# EAGLE design generic_victim (EAGLE 6.5.0)

## Sheet 1 of 5
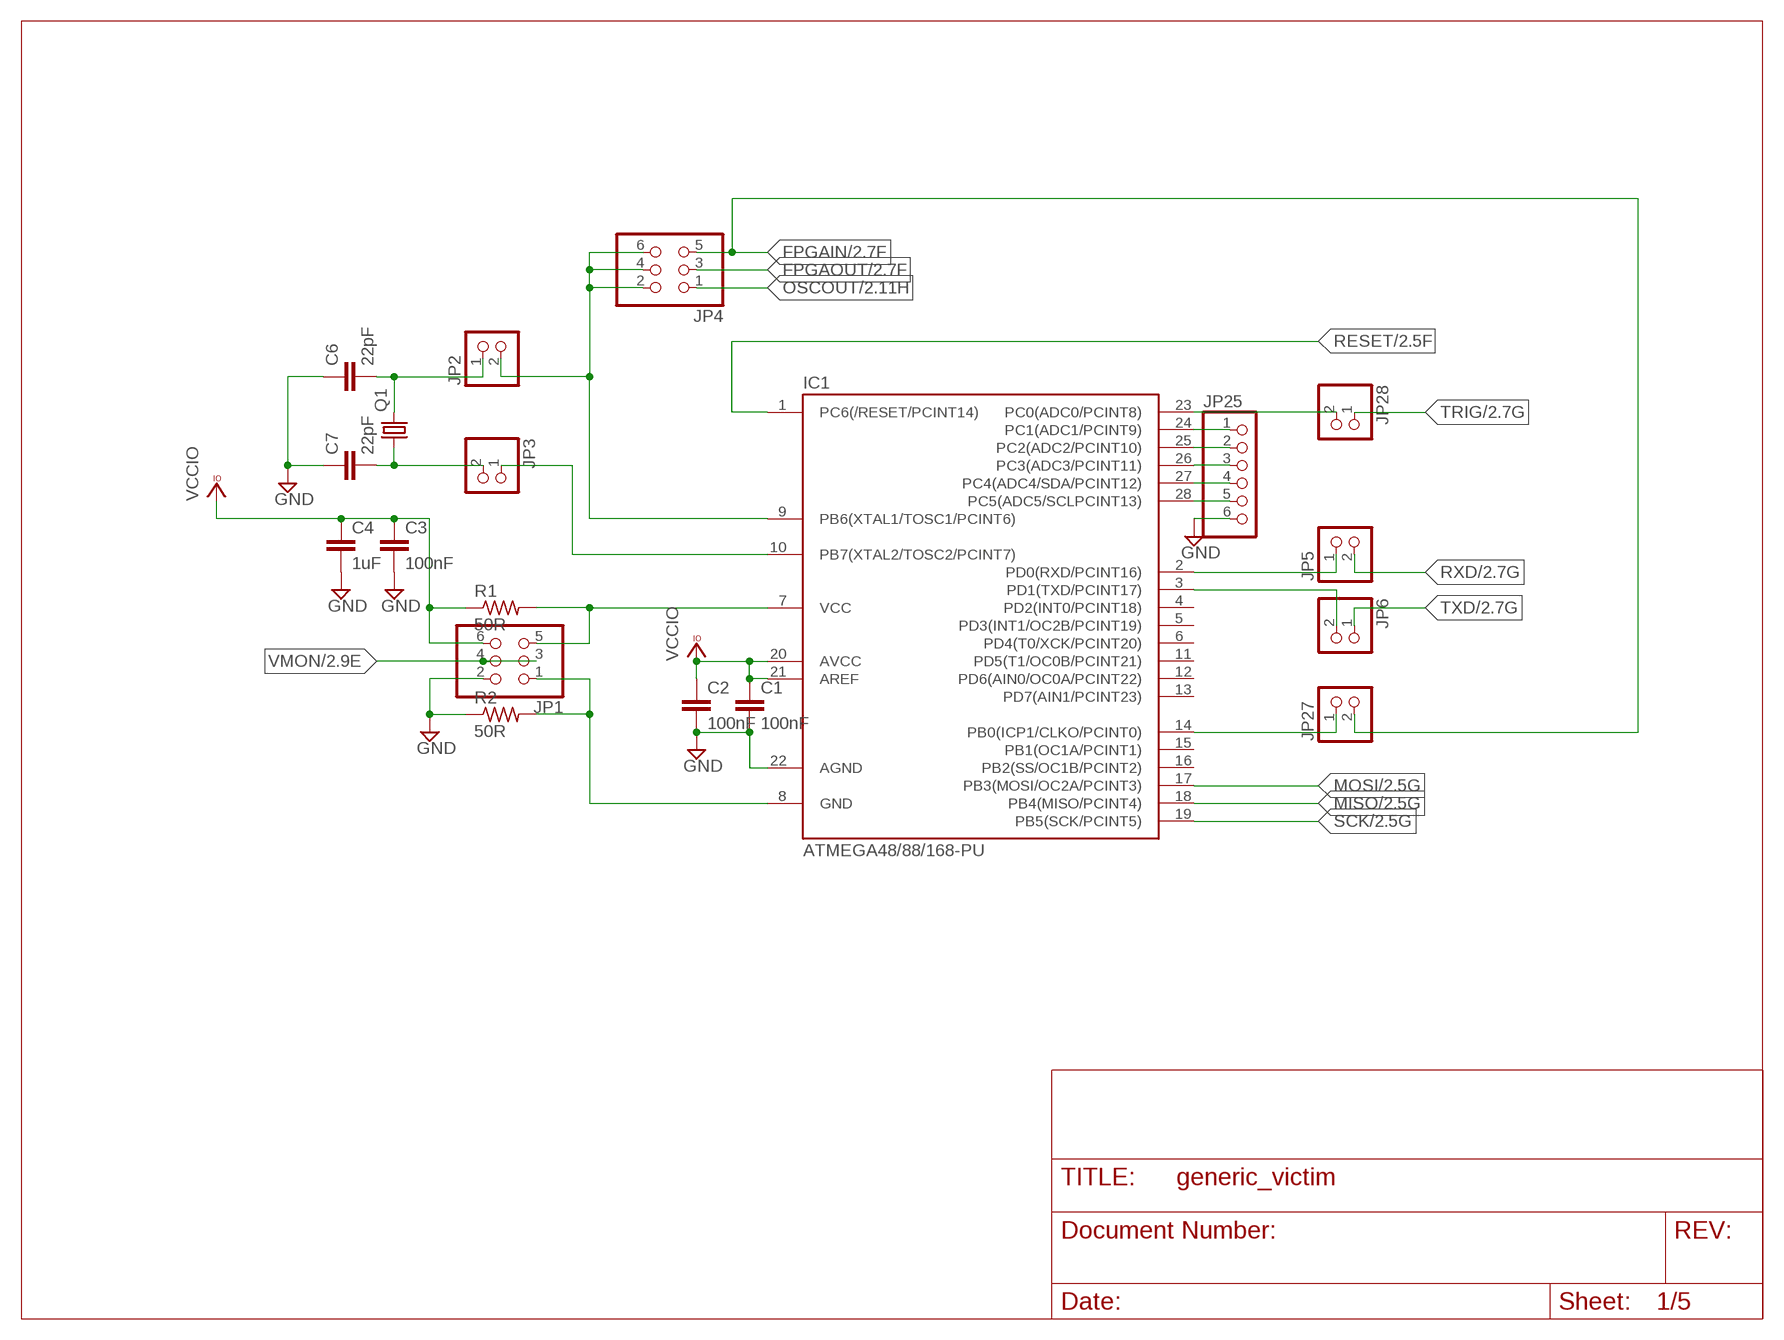
[diagram p0: schematic, sheet 1]

### Parts
C1  100nF  C-EUC0805  [C0805]
C2  100nF  C-EUC0805  [C0805]
C3  100nF  C-EUC0805  [C0805]
C4  1uF  C-EUC0805  [C0805]
C6  22pF  C-EUC0805  [C0805]
C7  22pF  C-EUC0805  [C0805]
IC1  ATMEGA48/88/168-PU  [DIL28-3]
JP1  PINHD-2X3  [2X03]
JP2  PINHD-1X2  [1X02]
JP3  PINHD-1X2  [1X02]
JP4  PINHD-2X3  [2X03]
JP5  PINHD-1X2  [1X02]
JP6  PINHD-1X2  [1X02]
JP25  PINHD-1X6  [1X06]
JP27  PINHD-1X2  [1X02]
JP28  PINHD-1X2  [1X02]
Q1  CRYSTALHC49U70  [HC49U70]
R1  50R  R-US_R0805  [R0805]
R2  50R  R-US_R0805  [R0805]

### Nets
FPGAIN: JP4.5 JP27.2 ; also sheet 2,3,4
FPGAOUT: JP4.3 ; also sheet 2,3
GND: C1.2 C2.2 C3.2 C4.2 C6.1 C7.1 IC1.22(AGND) JP1.2 JP25.6 R2.1 ; also sheet 2,3,4,5
MISO: IC1.18(PB4(MISO/PCINT4)) ; also sheet 2,3
MOSI: IC1.17(PB3(MOSI/OC2A/PCINT3)) ; also sheet 2,3
N$1: IC1.7(VCC) JP1.5 R1.2
N$3: IC1.8(GND) JP1.1 R2.2
N$4: IC1.10(PB7(XTAL2/TOSC2/PCINT7)) JP3.1
N$7: C7.2 JP3.2 Q1.1
N$8: C6.2 JP2.1 Q1.2
N$9: IC1.14(PB0(ICP1/CLKO/PCINT0)) JP27.1
N$10: IC1.2(PD0(RXD/PCINT16)) JP5.1
N$11: IC1.3(PD1(TXD/PCINT17)) JP6.2
N$31: IC1.9(PB6(XTAL1/TOSC1/PCINT6)) JP2.2 JP4.2 JP4.4 JP4.6
N$41: IC1.24(PC1(ADC1/PCINT9)) JP25.1
N$42: IC1.25(PC2(ADC2/PCINT10)) JP25.2
N$43: IC1.26(PC3(ADC3/PCINT11)) JP25.3
N$44: IC1.27(PC4(ADC4/SDA/PCINT12)) JP25.4
N$45: IC1.28(PC5(ADC5/SCLPCINT13)) JP25.5
N$47: IC1.23(PC0(ADC0/PCINT8)) JP28.2
OSCOUT: JP4.1 ; also sheet 2,3
RESET: IC1.1(PC6(/RESET/PCINT14)) ; also sheet 2,3
RXD: JP5.2 ; also sheet 2,3,4
SCK: IC1.19(PB5(SCK/PCINT5)) ; also sheet 2,3
TRIG: JP28.1 ; also sheet 2,3,4
TXD: JP6.1 ; also sheet 2,4
VCCIO: C1.1 C2.1 C3.1 C4.1 IC1.20(AVCC) IC1.21(AREF) JP1.6 R1.1 ; also sheet 2,3,4
VMON: JP1.3 JP1.4 ; also sheet 2,3,4,5
Unconnected: IC1.4(PD2(INT0/PCINT18)) IC1.5(PD3(INT1/OC2B/PCINT19)) IC1.6(PD4(T0/XCK/PCINT20)) IC1.11(PD5(T1/OC0B/PCINT21)) IC1.12(PD6(AIN0/OC0A/PCINT22)) IC1.13(PD7(AIN1/PCINT23)) IC1.15(PB1(OC1A/PCINT1)) IC1.16(PB2(SS/OC1B/PCINT2))

## Sheet 2 of 5
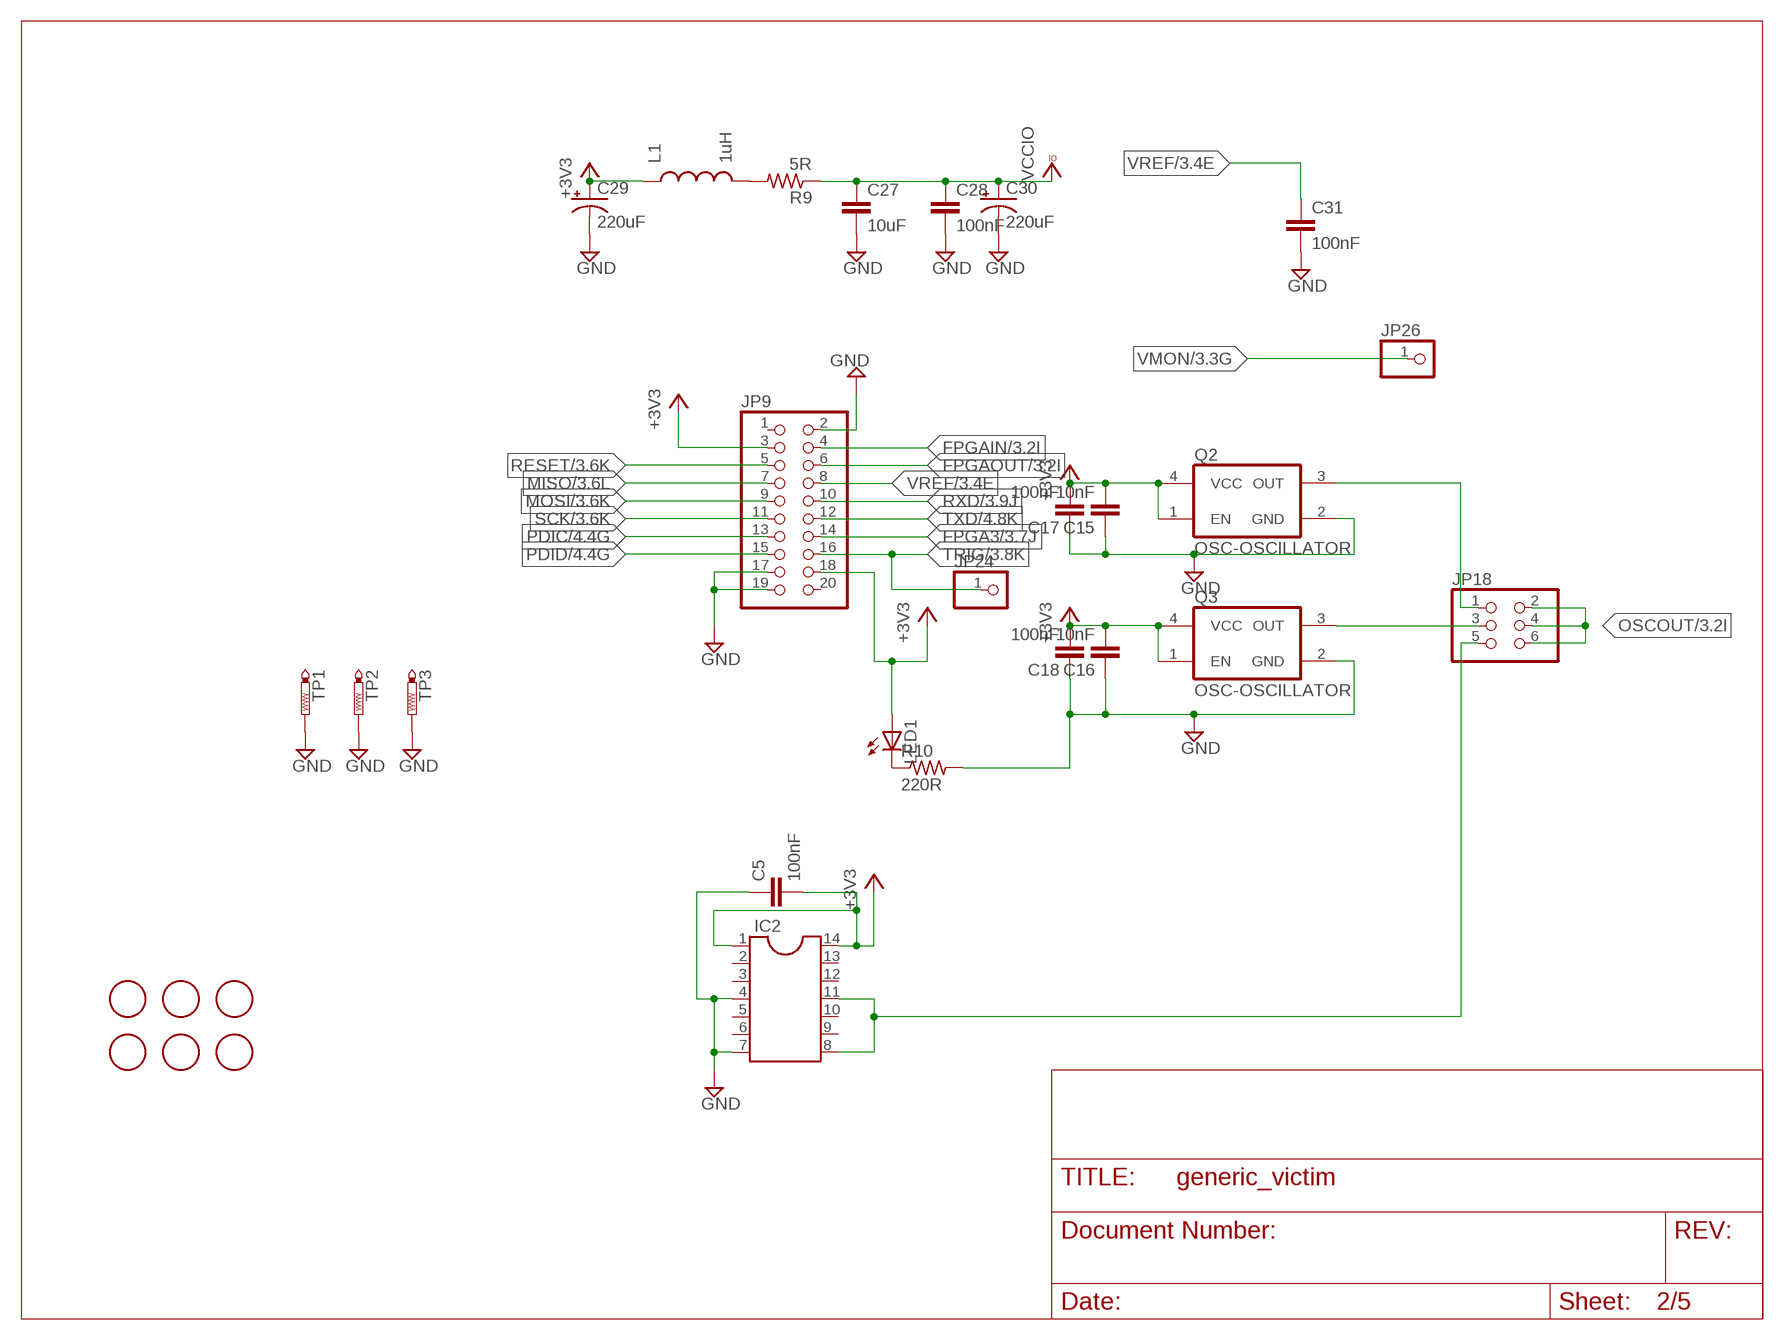
[diagram p1: schematic, sheet 2]

### Parts
C5  100nF  C-EUC0805  [C0805]
C15  10nF  C-EUC0603  [C0603]
C16  10nF  C-EUC0603  [C0603]
C17  100nF  C-EUC0603  [C0603]
C18  100nF  C-EUC0603  [C0603]
C27  10uF  C-EUC0805  [C0805]
C28  100nF  C-EUC0805  [C0805]
C29  220uF  CPOL-USE3.5-8  [E3,5-8]
C30  220uF  CPOL-USE3.5-8  [E3,5-8]
C31  100nF  C-EUC0805  [C0805]
IC2  DIL14S  [SOCKET-14]
JP9  PINHD-2X10  [2X10]
JP18  PINHD-2X3  [2X03]
JP24  PINHD-1X1  [1X01]
JP26  PINHD-1X1  [1X01]
L1  1uH  INDUCTOR0805  [0805]
LED1  LED3MM  [LED3MM]
Q2  OSC-OSCILLATOR  [OSCILLATOR_7X5_SMD]
Q3  OSC-OSCILLATOR  [OSCILLATOR_7X5_SMD]
R9  5R  R-US_R0805  [R0805]
R10  220R  R-US_R0805  [R0805]
TP1  PTR1PAD1-13  [P1-13]
TP2  PTR1PAD1-13  [P1-13]
TP3  PTR1PAD1-13  [P1-13]
U$1  FIDUCIAL  [FIDUCIAL_1MM]
U$2  FIDUCIAL  [FIDUCIAL_1MM]
U$3  FIDUCIAL  [FIDUCIAL_1MM]
U$4  FIDUCIAL  [FIDUCIAL_1MM]
U$5  FIDUCIAL  [FIDUCIAL_1MM]
U$6  FIDUCIAL  [FIDUCIAL_1MM]

### Nets
+3V3: C5.2 C15.2 C16.2 C17.2 C18.2 C29.+ IC2.1 IC2.14 JP9.3 JP9.18 L1.1 LED1.A Q2.1(EN) Q2.4(VCC) Q3.1(EN) Q3.4(VCC) ; also sheet 5
FPGA3: JP9.14 ; also sheet 3
FPGAIN: JP9.4 ; also sheet 1,3,4
FPGAOUT: JP9.6 ; also sheet 1,3
GND: C5.1 C15.1 C16.1 C17.1 C18.1 C27.2 C28.2 C29.- C30.- C31.2 IC2.4 IC2.7 JP9.2 JP9.17 JP9.19 Q2.2(GND) Q3.2(GND) R10.2 TP1.TP TP2.TP TP3.TP ; also sheet 1,3,4,5
MISO: JP9.7 ; also sheet 1,3
MOSI: JP9.9 ; also sheet 1,3
N$6: IC2.8 IC2.11 JP18.5
N$34: JP18.3 Q3.3(OUT)
N$35: JP18.1 Q2.3(OUT)
N$40: L1.2 R9.2
N$46: LED1.K(C) R10.1
OSCOUT: JP18.2 JP18.4 JP18.6 ; also sheet 1,3
PDIC: JP9.13 ; also sheet 4
PDID: JP9.15 ; also sheet 4
RESET: JP9.5 ; also sheet 1,3
RXD: JP9.10 ; also sheet 1,3,4
SCK: JP9.11 ; also sheet 1,3
TRIG: JP9.16 JP24.1 ; also sheet 1,3,4
TXD: JP9.12 ; also sheet 1,4
VCCIO: C27.1 C28.1 C30.+ R9.1 ; also sheet 1,3,4
VMON: JP26.1 ; also sheet 1,3,4,5
VREF: C31.1 JP9.8 ; also sheet 3
Unconnected: IC2.2 IC2.3 IC2.5 IC2.6 IC2.9 IC2.10 IC2.12 IC2.13 JP9.1 JP9.20

## Sheet 3 of 5
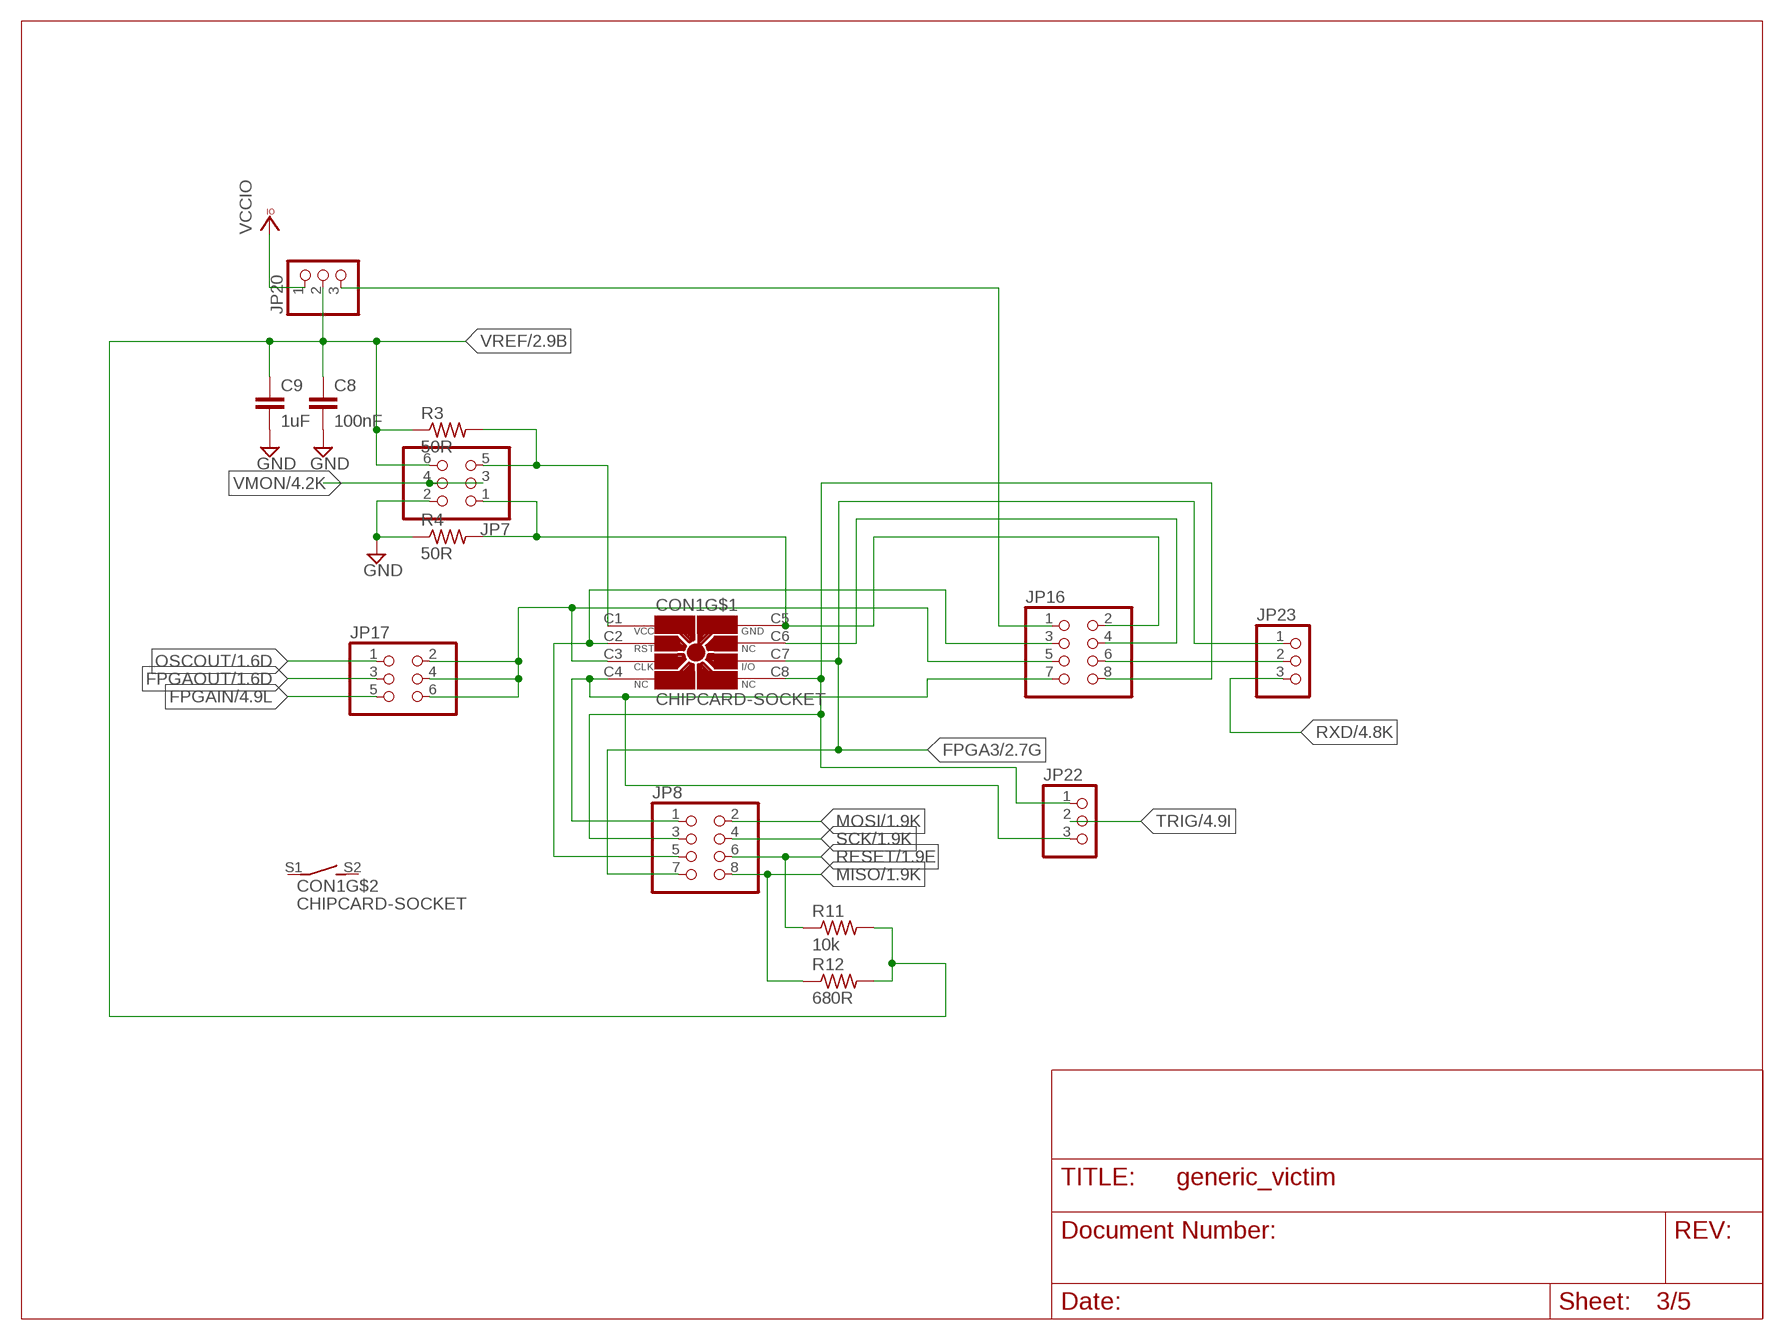
[diagram p2: schematic, sheet 3]

### Parts
C8  100nF  C-EUC0805  [C0805]
C9  1uF  C-EUC0805  [C0805]
CON1  CHIPCARD-SOCKET  [7334L2622F05LF]
JP7  PINHD-2X3  [2X03]
JP8  PINHD-2X4  [2X04]
JP16  PINHD-2X4  [2X04]
JP17  PINHD-2X3  [2X03]
JP20  PINHD-1X3  [1X03]
JP22  PINHD-1X3  [1X03]
JP23  PINHD-1X3  [1X03]
R3  50R  R-US_R0805  [R0805]
R4  50R  R-US_R0805  [R0805]
R11  10k  R-US_R0805  [R0805]
R12  680R  R-US_R0805  [R0805]

### Nets
FPGA3: CON1.C7(I/O) JP8.7 JP23.1 ; also sheet 2
FPGAIN: JP17.5 ; also sheet 1,2,4
FPGAOUT: JP17.3 ; also sheet 1,2
GND: C8.2 C9.2 JP7.2 R4.1 ; also sheet 1,2,4,5
MISO: JP8.8 R12.1 ; also sheet 1,2
MOSI: JP8.2 ; also sheet 1,2
N$2: CON1.C4(NC) JP8.1 JP16.7 JP22.3
N$12: CON1.C1(VCC) JP7.5 R3.2
N$13: CON1.C2(RST) JP8.5 JP16.3
N$14: CON1.C5(GND) JP7.1 JP16.2 R4.2
N$16: CON1.C8(NC) JP8.3 JP16.8 JP22.1
N$18: JP16.6 JP23.2
N$29: CON1.C6(NC) JP16.4
N$30: CON1.C3(CLK) JP16.5 JP17.2 JP17.4 JP17.6
N$32: JP16.1 JP20.3
OSCOUT: JP17.1 ; also sheet 1,2
RESET: JP8.6 R11.1 ; also sheet 1,2
RXD: JP23.3 ; also sheet 1,2,4
SCK: JP8.4 ; also sheet 1,2
TRIG: JP22.2 ; also sheet 1,2,4
VCCIO: JP20.1 ; also sheet 1,2,4
VMON: JP7.3 JP7.4 ; also sheet 1,2,4,5
VREF: C8.1 C9.1 JP7.6 JP20.2 R3.1 R11.2 R12.2 ; also sheet 2
Unconnected: CON1.S1 CON1.S2

## Sheet 4 of 5
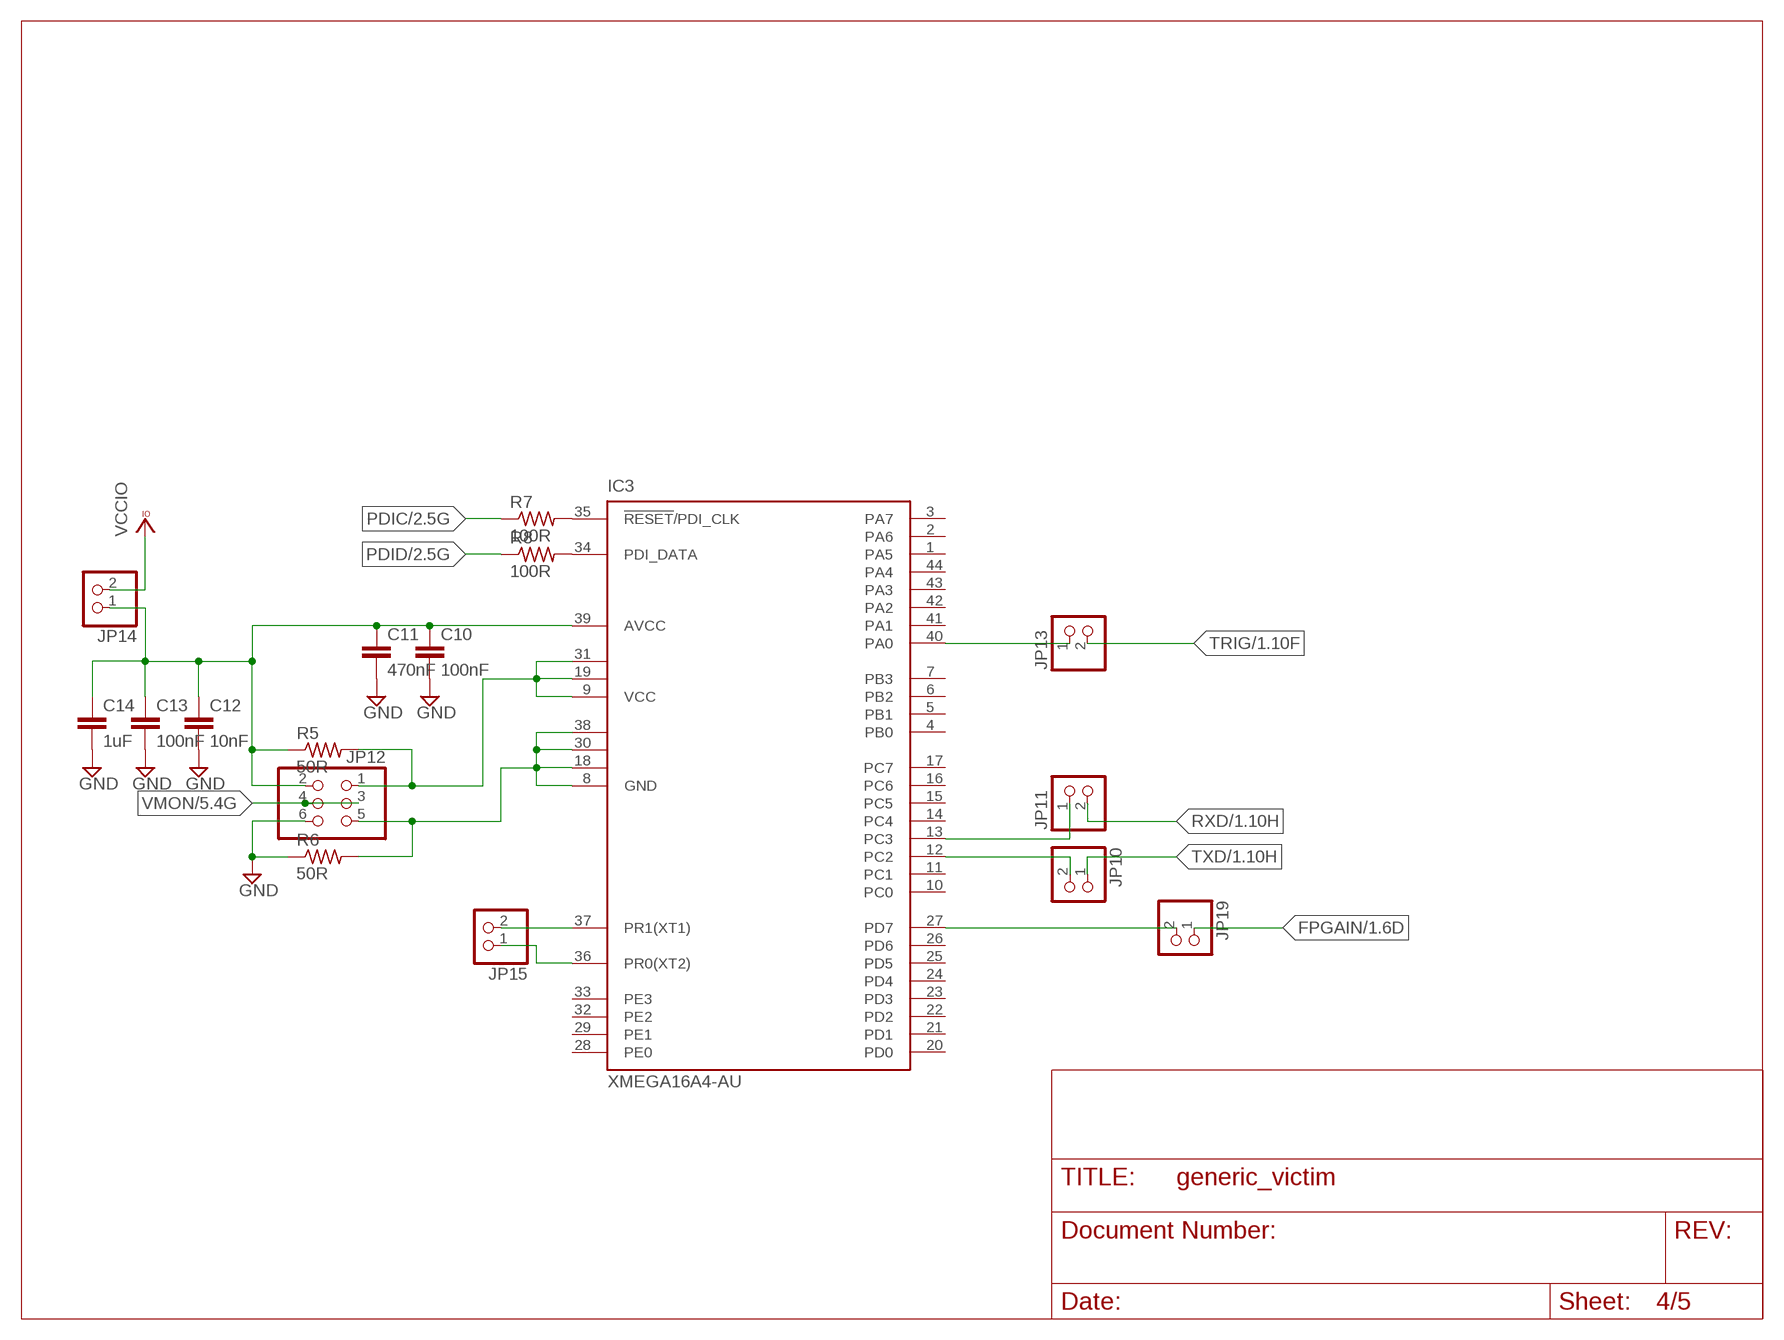
[diagram p3: schematic, sheet 4]

### Parts
C10  100nF  C-EUC0805  [C0805]
C11  470nF  C-EUC0805  [C0805]
C12  10nF  C-EUC0805  [C0805]
C13  100nF  C-EUC0805  [C0805]
C14  1uF  C-EUC0805  [C0805]
IC3  XMEGA16A4-AU  XMEGA16A4A  [TQFP44]
JP10  PINHD-1X2  [1X02]
JP11  PINHD-1X2  [1X02]
JP12  PINHD-2X3  [2X03]
JP13  PINHD-1X2  [1X02]
JP14  PINHD-1X2  [1X02]
JP15  PINHD-1X2  [1X02]
JP19  PINHD-1X2  [1X02]
R5  50R  R-US_R0805  [R0805]
R6  50R  R-US_R0805  [R0805]
R7  100R  R-US_M0805  [M0805]
R8  100R  R-US_M0805  [M0805]

### Nets
FPGAIN: JP19.1 ; also sheet 1,2,3
GND: C10.2 C11.2 C12.2 C13.2 C14.2 JP12.6 R6.1 ; also sheet 1,2,3,5
N$17: IC3.13(PC3) JP11.1
N$19: IC3.12(PC2) JP10.2
N$20: IC3.27(PD7) JP19.2
N$21: C10.1 C11.1 C12.1 C13.1 C14.1 IC3.39(AVCC) JP12.2 JP14.1 R5.1
N$22: IC3.35(!RESET!/PDI_CLK) R7.2
N$23: IC3.34(PDI_DATA) R8.2
N$24: IC3.40(PA0) JP13.1
N$25: IC3.9(VCC) IC3.19(VCC1) IC3.31(VCC2) JP12.1 R5.2
N$26: IC3.8(GND) IC3.18(GND1) IC3.30(GND2) IC3.38(GND3) JP12.5 R6.2
N$27: IC3.37(PR1(XT1)) JP15.2
N$28: IC3.36(PR0(XT2)) JP15.1
PDIC: R7.1 ; also sheet 2
PDID: R8.1 ; also sheet 2
RXD: JP11.2 ; also sheet 1,2,3
TRIG: JP13.2 ; also sheet 1,2,3
TXD: JP10.1 ; also sheet 1,2
VCCIO: JP14.2 ; also sheet 1,2,3
VMON: JP12.3 JP12.4 ; also sheet 1,2,3,5
Unconnected: IC3.1(PA5) IC3.2(PA6) IC3.3(PA7) IC3.4(PB0) IC3.5(PB1) IC3.6(PB2) IC3.7(PB3) IC3.10(PC0) IC3.11(PC1) IC3.14(PC4) IC3.15(PC5) IC3.16(PC6) IC3.17(PC7) IC3.20(PD0) IC3.21(PD1) IC3.22(PD2) IC3.23(PD3) IC3.24(PD4) IC3.25(PD5) IC3.26(PD6) IC3.28(PE0) IC3.29(PE1) IC3.32(PE2) IC3.33(PE3) IC3.41(PA1) IC3.42(PA2) IC3.43(PA3) IC3.44(PA4)

## Sheet 5 of 5
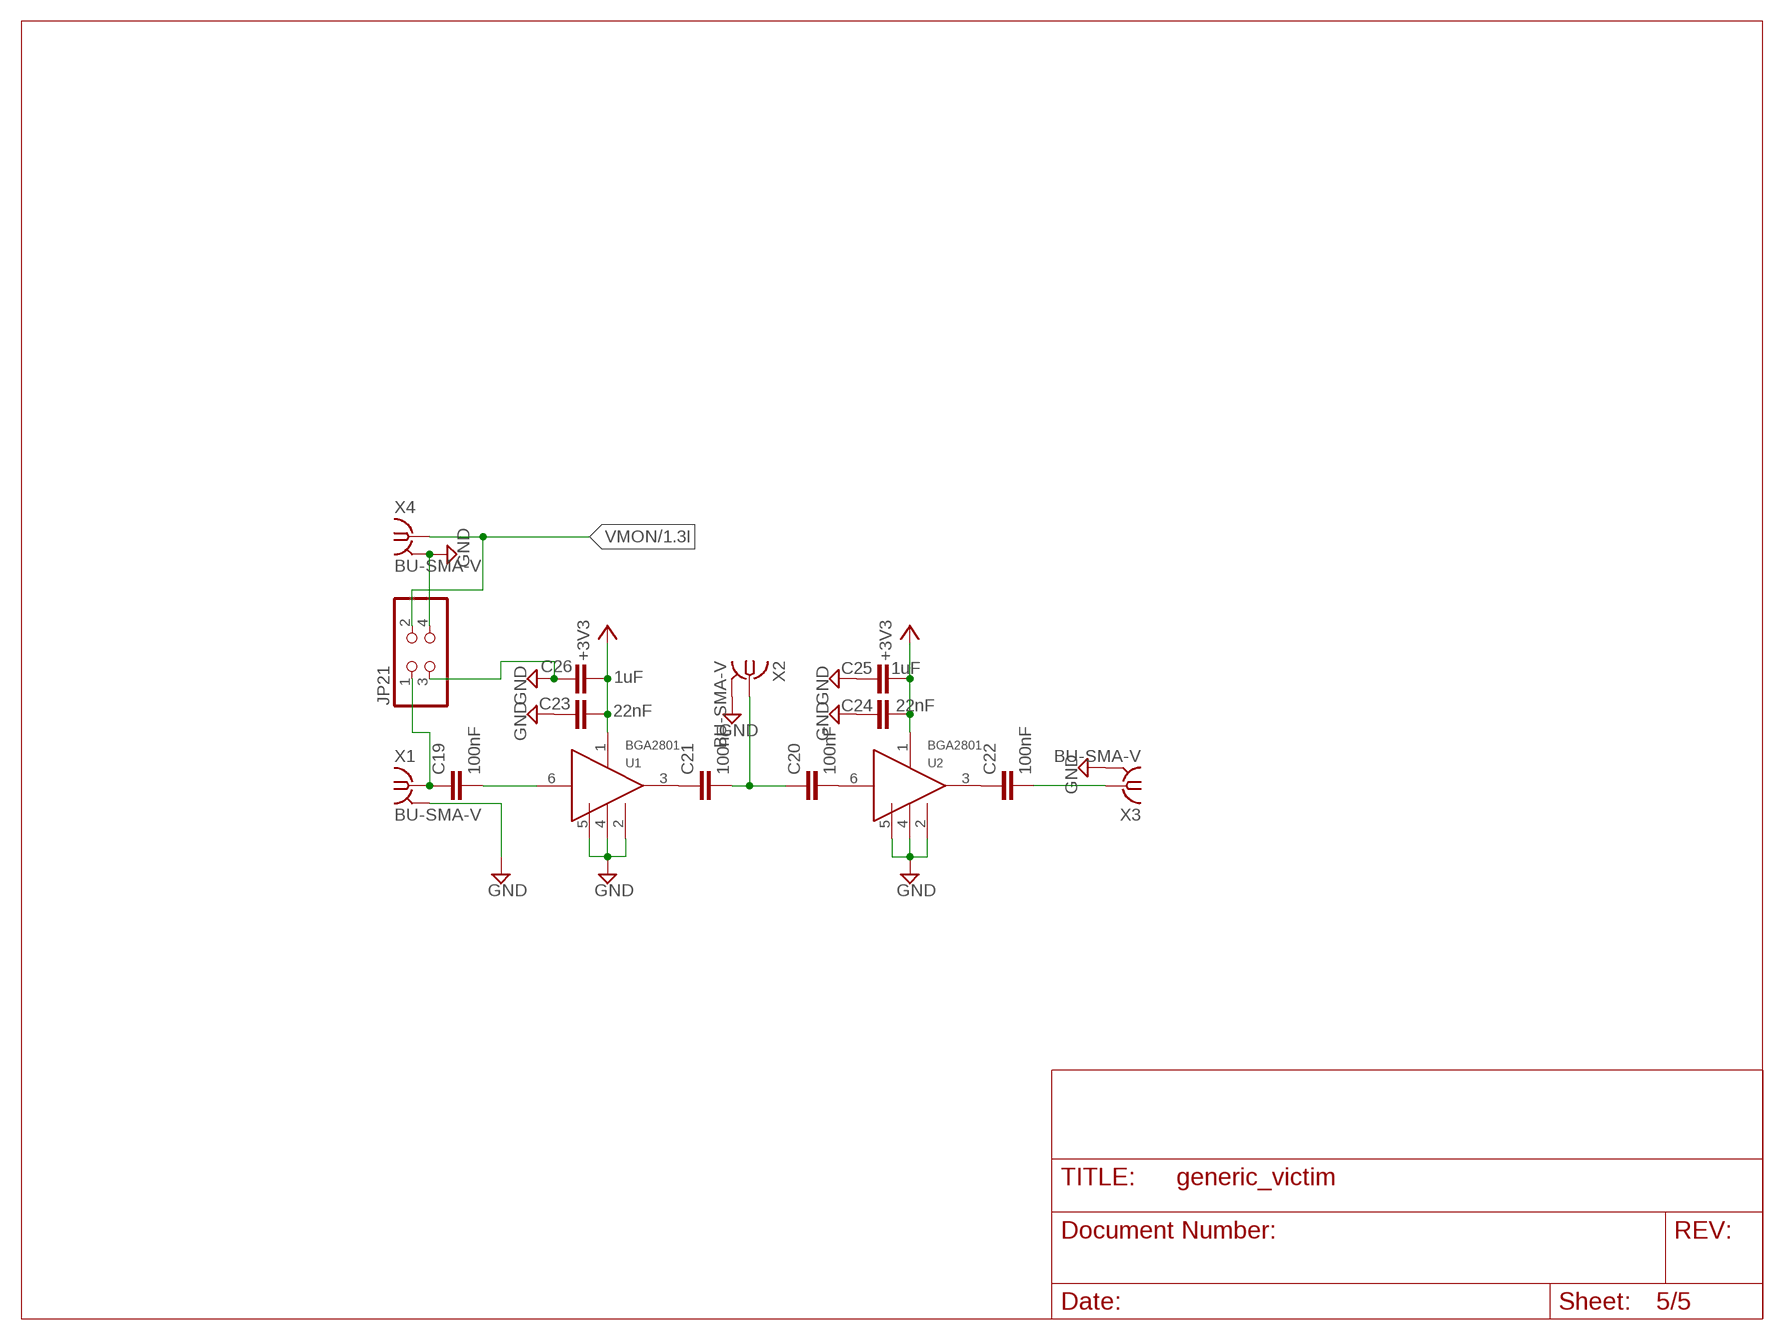
[diagram p4: schematic, sheet 5]

### Parts
C19  100nF  C-EUC0603  [C0603]
C20  100nF  C-EUC0603  [C0603]
C21  100nF  C-EUC0603  [C0603]
C22  100nF  C-EUC0603  [C0603]
C23  22nF  C-EUC0603  [C0603]
C24  22nF  C-EUC0603  [C0603]
C25  1uF  C-EUC0603  [C0603]
C26  1uF  C-EUC0603  [C0603]
JP21  PINHD-2X2  [2X02]
U1  BGA2801  [SOTT323-6]
U2  BGA2801  [SOTT323-6]
X1  BU-SMA-V  [BU-SMA-V]
X2  BU-SMA-V  [BU-SMA-V]
X3  BU-SMA-V  [BU-SMA-V]
X4  BU-SMA-V  [BU-SMA-V]

### Nets
+3V3: C23.2 C24.2 C25.2 C26.2 U1.1(VCC) U2.1(VCC) ; also sheet 2
GND: C23.1 C24.1 C25.1 C26.1 JP21.3 JP21.4 U1.2(GND) U1.4(GND) U1.5(GND) U2.2(GND) U2.4(GND) U2.5(GND) X1.2 X1.3 X1.4 X1.5 X2.2 X2.3 X2.4 X2.5 X3.2 X3.3 X3.4 X3.5 X4.2 X4.3 X4.4 X4.5 ; also sheet 1,2,3,4
N$5: C19.1 JP21.1 X1.1
N$15: C22.2 X3.1
N$33: C22.1 U2.3(OUT)
N$36: C21.1 U1.3(OUT)
N$37: C20.2 U2.6(IN)
N$38: C19.2 U1.6(IN)
N$39: C20.1 C21.2 X2.1
VMON: JP21.2 X4.1 ; also sheet 1,2,3,4

## Library data of the parts
C1-C18 = resistor:C-EU: CAPACITOR, European symbol
C19-C28 C31 = rcl:C-EU: CAPACITOR, European symbol
C29 C30 = rcl:CPOL-US: POLARIZED CAPACITOR, American symbol
CON1 = customs:CHIPCARD-SOCKET
IC1 = atmega8:ATMEGA48/88/168-PU
IC2 = ic-package:DIL14: Dual In Line / Socket
IC3 = atmel:XMEGA16A4: MICROCONTROLLER Features High-performance, Low-power 8/16-bit AVR XMEGA Microcontroller Non-Volatile Program and Data Memories - 16 KB - 128 KB of In-System Self-Programmable Flash - 4 KB - 8 KB Boot Code Section with Independent Lock Bits - 1 KB - 2 KB EEPROM - 2 KB - 8 KB Internal SRAM Peripheral Features - Four-channel DMA Controller with support for external requests - Eight-channel Event System - Five 16-bit Timer/Counters Three Timer/Counters with 4 Output Compare or Input Capture channels Two Timer/Counters with 2 Output Compare or Input Capture channels High-Resolution Extensions on all Timer/Counters Advanced Waveform Extension on one Timer/Counter - Five USARTs IrDA Extension on one USART - Two Two-Wire Interfaces with dual address match (I2C and SMBus compatible) - Two SPIs (Serial Peripheral Interfaces) peripherals - AES and DES Crypto Engine - 16-bit Real Time Counter with Separate Oscillator - One Twelve-channel, 12-bit, 2 Msps Analog to Digital Converter - One Two-channel, 12-bit, 1 Msps Digital to Analog Converter - Two Analog Comparators with Window compare function - External Interrupts on all General Purpose I/O pins - Programmable Watchdog Timer with Separate On-chip Ultra Low Power Oscillator Special Microcontroller Features - Power-on Reset and Programmable Brown-out Detection - Internal and External Clock Options with PLL - Programmable Multi-level Interrupt Controller - Sleep Modes: Idle, Power-down, Standby, Power-save, Extended Standby - Advanced Programming, Test and Debugging Interfaces PDI (Program and Debug Interface) for programming, test and debugging I/O and Packages - 34 Programmable I/O Lines - 44 - lead TQFP - 44 - pad VQFN/QFN - 49 - ball VFBGA Operating Voltage - 1.6 - 3.6V Speed performance - 0 - 12 MHz @ 1.6 - 3.6V - 0 - 32 MHz @ 2.7 - 3.6V Drawn by Dipl.-Ing. (FH) Robert Siegler Created: 27.05.09; OC_FARNELL: unknown; OC_NEWARK: unknown
JP1 JP4 JP7 JP12 JP17 JP18 = pinhead:PINHD-2X3: PIN HEADER
JP2 JP3 JP5 JP6 JP10 JP11 JP13-JP15 JP19 JP27 JP28 = pinhead:PINHD-1X2: PIN HEADER
JP8 JP16 = pinhead:PINHD-2X4: PIN HEADER
JP9 = pinhead:PINHD-2X10: PIN HEADER
JP20 JP22 JP23 = pinhead:PINHD-1X3: PIN HEADER
JP21 = pinhead:PINHD-2X2: PIN HEADER
JP24 JP26 = pinhead:PINHD-1X1: PIN HEADER
JP25 = pinhead:PINHD-1X6: PIN HEADER
L1 = SparkFun:INDUCTOR: Inductors Basic Inductor/Choke - 0603 and 1206. Footprints are not proven and vary greatly between part numbers.
LED1 = adafruit:LED: LED OSRAM: - CHIPLED LG R971, LG N971, LY N971, LG Q971, LY Q971, LO R971, LY R971 LH N974, LH R974 LS Q976, LO Q976, LY Q976 LO Q996 - Hyper CHIPLED LW Q18S LB Q993, LB Q99A, LB R99A - SideLED LS A670, LO A670, LY A670, LG A670, LP A670 LB A673, LV A673, LT A673, LW A673 LH A674 LY A675 LS A676, LA A676, LO A676, LY A676, LW A676 LS A679, LY A679, LG A679 - Hyper Micro SIDELED® LS Y876, LA Y876, LO Y876, LY Y876 LT Y87S - SmartLED LW L88C, LW L88S LB L89C, LB L89S, LG L890 LS L89K, LO L89K, LY L89K LS L896, LA L896, LO L896, LY L896 - TOPLED LS T670, LO T670, LY T670, LG T670, LP T670 LSG T670, LSP T670, LSY T670, LOP T670, LYG T670 LG T671, LOG T671, LSG T671 LB T673, LV T673, LT T673, LW T673 LH T674 LS T676, LA T676, LO T676, LY T676, LB T676, LH T676, LSB T676, LW T676 LB T67C, LV T67C, LT T67C, LS T67K, LO T67K, LY T67K, LW E67C LS E67B, LA E67B, LO E67B, LY E67B, LB E67C, LV E67C, LT E67C LW T67C LS T679, LY T679, LG T679 LS T770, LO T770, LY T770, LG T770, LP T770 LB T773, LV T773, LT T773, LW T773 LH T774 LS E675, LA E675, LY E675, LS T675 LS T776, LA T776, LO T776, LY T776, LB T776 LHGB T686 LT T68C, LB T68C - Hyper Mini TOPLED® LB M676 - Mini TOPLED Santana® LG M470 LS M47K, LO M47K, LY M47K Source: http://www.osram.convergy.de/
Q1 = crystal:CRYSTAL: CRYSTAL; OC_FARNELL: unknown; OC_NEWARK: unknown
Q2 Q3 = dp_devices:OSC-OSCILLATOR: Oscillator
R1-R8 R10-R12 = resistor:R-US_: RESISTOR, American symbol
R9 = adafruit:R-US_: RESISTOR, American symbol
TP1-TP3 = testpad:PTR1: TEST PIN
U1 U2 = customs:BGA2801
U$1-U$6 = adafruit:FIDUCIAL: For use by pick and place machines to calibrate the vision/machine, 1mm By microbuilder.eu
X1-X4 = con-coax:BU-SMA-V: FEMALE SMA CONNECTOR Radiall distributor RS 112-3794; OC_FARNELL: unknown; OC_NEWARK: unknown

## Board
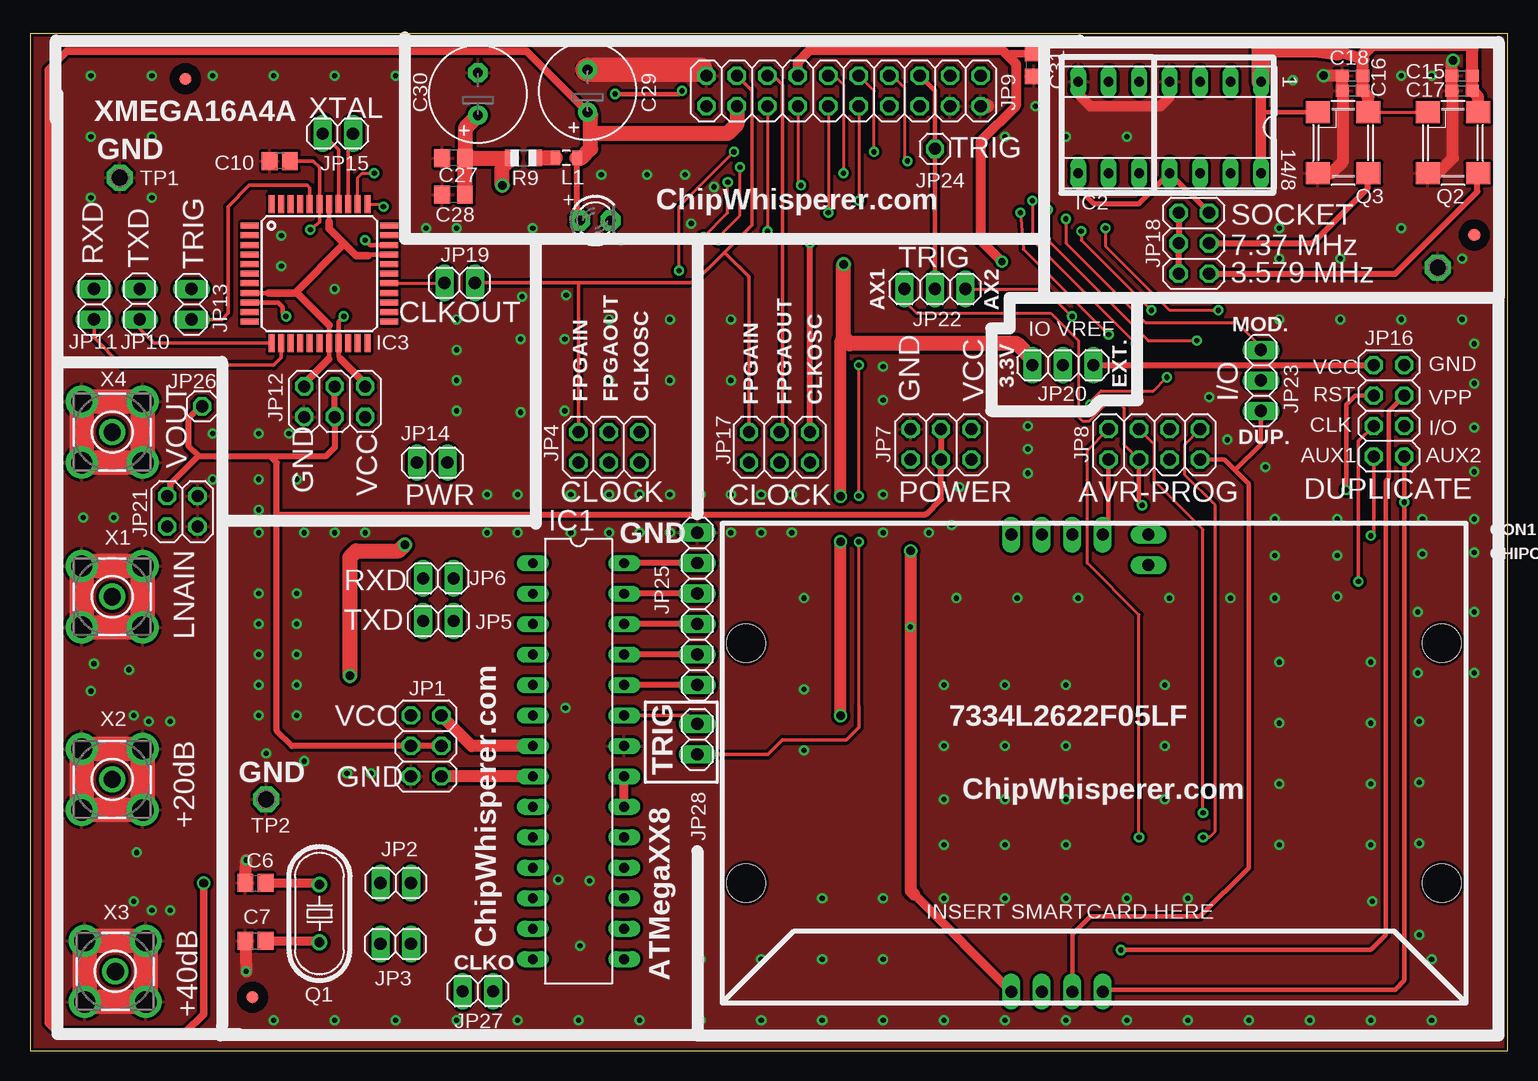
[diagram p5: board, top side]
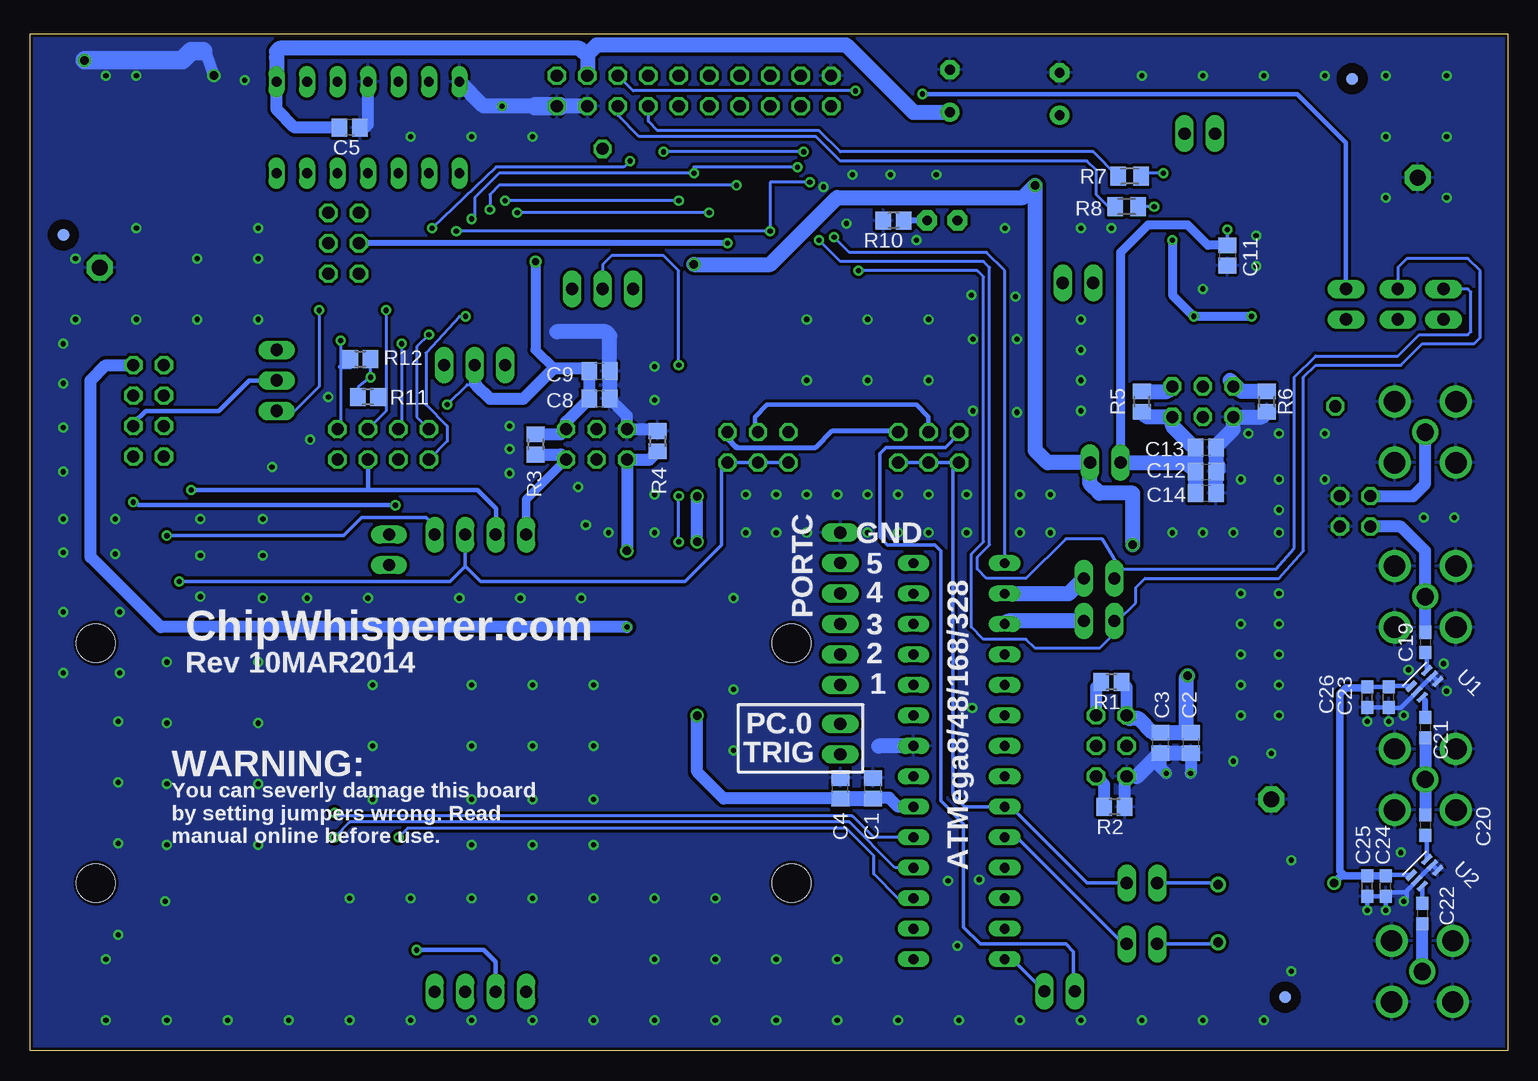
[diagram p6: board, bottom side, seen from below]

Size 123.17 x 84.76 mm. Coordinates in mm from the lower left corner, seen from the top.
Outline: 0,0 123.17,0 123.17,84.76 0,84.76 0,0
Copper layers (1*16): Top 0.035mm / dielectric 1.5mm / Bottom 0.035mm
Design rules "default *": minimum track width 7mil, minimum drill 17mil, track to track 8mil, track to pad 8mil, pad to pad 8mil, via to via 8mil, smd to smd 7mil, copper to edge 5mil, drill to drill 8mil, minimum pad ring 10mil, minimum via ring 8mil, stop-mask expansion 4mil, vias tented up to drill 30mil, thermal gap 10mil

### Footprints (pad centres in the part's own frame; a part is rotated, then mirrored left to right if it is on the bottom)
C0805 = smd 1.3 x 1.5: 1 -0.85,0; 2 0.85,0
C0603 = smd 1.1 x 1: 1 -0.85,0; 2 0.85,0
C0805' = smd 1.3 x 1.5: 1 -0.95,0; 2 0.95,0
E3,5-8 = drill 0.813 pad 1.6: + -1.778,0 | drill 0.813 pad 1.6 octagon: - 1.778,0
7334L2622F05LF = drill 1 long: C1 22.12,29.05; C2 24.66,29.05; C3 27.2,29.05; C4 29.74,29.05; C5 22.12,-9.05; C6 24.66,-9.05; C7 27.2,-9.05; C8 29.74,-9.05; S1 33.55,29.05; S2 33.55,26.51 | hole 3.2: 0,0; 0,20; 58,20; 58,0
DIL28-3 = drill 0.813 long: 1 -16.51,-3.81; 2 -13.97,-3.81; 3 -11.43,-3.81; 4 -8.89,-3.81; 5 -6.35,-3.81; 6 -3.81,-3.81; 7 -1.27,-3.81; 8 1.27,-3.81; 9 3.81,-3.81; 10 6.35,-3.81; 11 8.89,-3.81; 12 11.43,-3.81; 13 13.97,-3.81; 14 16.51,-3.81; 15 16.51,3.81; 16 13.97,3.81; 17 11.43,3.81; 18 8.89,3.81; 19 6.35,3.81; 20 3.81,3.81; 21 1.27,3.81; 22 -1.27,3.81; 23 -3.81,3.81; 24 -6.35,3.81; 25 -8.89,3.81; 26 -11.43,3.81; 27 -13.97,3.81; 28 -16.51,3.81
SOCKET-14 = drill 0.813 long: 1 -7.62,-3.81; 2 -5.08,-3.81; 3 -2.54,-3.81; 4 0,-3.81; 5 2.54,-3.81; 6 5.08,-3.81; 7 7.62,-3.81; 8 7.62,3.81; 9 5.08,3.81; 10 2.54,3.81; 11 0,3.81; 12 -2.54,3.81; 13 -5.08,3.81; 14 -7.62,3.81
TQFP44 = smd 1.5 x 0.5: 1 -5.8,4; 2 -5.8,3.2; 3 -5.8,2.4; 4 -5.8,1.6; 5 -5.8,0.8; 6 -5.8,0; 7 -5.8,-0.8; 8 -5.8,-1.6; 9 -5.8,-2.4; 10 -5.8,-3.2; 11 -5.8,-4; 23 5.8,-4; 24 5.8,-3.2; 25 5.8,-2.4; 26 5.8,-1.6; 27 5.8,-0.8; 28 5.8,0; 29 5.8,0.8; 30 5.8,1.6; 31 5.8,2.4; 32 5.8,3.2; 33 5.8,4 | smd 0.5 x 1.5: 12 -4,-5.8; 13 -3.2,-5.8; 14 -2.4,-5.8; 15 -1.6,-5.8; 16 -0.8,-5.8; 17 0,-5.8; 18 0.8,-5.8; 19 1.6,-5.8; 20 2.4,-5.8; 21 3.2,-5.8; 22 4,-5.8; 34 4,5.8; 35 3.2,5.8; 36 2.4,5.8; 37 1.6,5.8; 38 0.8,5.8; 39 0,5.8; 40 -0.8,5.8; 41 -1.6,5.8; 42 -2.4,5.8; 43 -3.2,5.8; 44 -4,5.8
2X03 = drill 1.016 octagon: 1 -2.54,-1.27; 2 -2.54,1.27; 3 0,-1.27; 4 0,1.27; 5 2.54,-1.27; 6 2.54,1.27
1X02 = drill 1.016 long: 1 -1.27,0; 2 1.27,0
2X04 = drill 1.016 octagon: 1 -3.81,-1.27; 2 -3.81,1.27; 3 -1.27,-1.27; 4 -1.27,1.27; 5 1.27,-1.27; 6 1.27,1.27; 7 3.81,-1.27; 8 3.81,1.27
2X10 = drill 1.016 octagon: 1 -11.43,-1.27; 2 -11.43,1.27; 3 -8.89,-1.27; 4 -8.89,1.27; 5 -6.35,-1.27; 6 -6.35,1.27; 7 -3.81,-1.27; 8 -3.81,1.27; 9 -1.27,-1.27; 10 -1.27,1.27; 11 1.27,-1.27; 12 1.27,1.27; 13 3.81,-1.27; 14 3.81,1.27; 15 6.35,-1.27; 16 6.35,1.27; 17 8.89,-1.27; 18 8.89,1.27; 19 11.43,-1.27; 20 11.43,1.27
1X03 = drill 1.016 long: 1 -2.54,0; 2 0,0; 3 2.54,0
2X02 = drill 1.016 octagon: 1 -1.27,-1.27; 2 -1.27,1.27; 3 1.27,-1.27; 4 1.27,1.27
1X01 = drill 1.016 octagon: 1 0,0
1X06 = drill 1.016 long: 1 -6.35,0; 2 -3.81,0; 3 -1.27,0; 4 1.27,0; 5 3.81,0; 6 6.35,0
0805 = smd 0.8 x 1.2: 1 -0.9,0; 2 0.9,0
LED3MM = drill 0.813 pad 1.676 octagon: A -1.27,0; K 1.27,0
HC49U70 = drill 0.813: 1 -2.413,0; 2 2.413,0
OSCILLATOR_7X5_SMD = smd 1.8 x 2: 1 -2.54,-2.1; 2 2.54,-2.1; 3 2.54,2.1; 4 -2.54,2.1
R0805 = smd 1.3 x 1.5: 1 -0.85,0; 2 0.85,0
M0805 = smd 1.3 x 1.6: 1 -0.95,0; 2 0.95,0
R0805' = smd 1.1 x 1.4: 1 -1,0; 2 1,0
P1-13 = drill 1.321 pad 2.159 octagon: TP 0,0
SOTT323-6 = smd 0.4 x 1.05: 1 -1.3,0; 2 -0.65,0; 3 0,0; 4 0,1.85; 5 -0.65,1.85; 6 -1.3,1.85
FIDUCIAL_1MM = smd 1 x 1: 1 0,0
BU-SMA-V = drill 1.448: 1 0,0 | drill 1.778: 2 -2.55,2.55; 3 2.55,2.55; 4 2.55,-2.55; 5 -2.55,-2.55

### Placement (x,y rotation side)
C1  52.91,21.87 90 bottom
C2  26.42,25.65 270 bottom
C3  28.96,25.65 270 bottom
C4  55.63,21.87 90 bottom
C5  96.52,76.96 180 bottom
C6  18.8,13.97 0 top
C7  18.8,9.14 0 top
C8  75.69,54.36 0 bottom
C9  75.69,56.64 0 bottom
C10  20.83,74.17 180 top
C11  23.37,66.29 270 bottom
C12  25.15,48.26 0 bottom
C13  25.15,50.29 0 bottom
C14  25.15,46.48 0 bottom
C15  119.38,81.28 0 top
C16  110.24,80.01 0 top
C17  119.38,80.01 0 top
C18  110.24,81.28 0 top
C19  6.86,34.04 270 bottom
C20  6.86,18.8 270 bottom
C21  6.86,26.92 270 bottom
C22  7.11,11.43 270 bottom
C23  9.91,29.46 90 bottom
C24  10.16,13.72 90 bottom
C25  11.68,13.72 90 bottom
C26  11.68,29.46 90 bottom
C27  10uF  [C0805']  35.31,74.42 180 top
C28  100nF  [C0805']  35.31,71.37 180 top
C29  46.48,80.01 90 top
C30  37.34,79.76 90 top
C31  100nF  [C0805']  83.69,82.17 270 top
CON1  59.69,13.97 0 top
IC1  45.72,24.13 270 top
IC2  95,76.96 180 top
IC3  24.13,64.77 0 top
JP1  33.02,25.4 90 top
JP2  30.48,13.97 0 top
JP3  30.48,8.89 180 top
JP4  48.26,50.29 180 top
JP5  34.04,39.37 180 top
JP6  34.04,35.81 0 top
JP7  75.95,50.55 0 top
JP8  93.73,50.55 0 top
JP9  67.82,80.01 0 top
JP10  9.14,62.23 270 top
JP11  5.33,62.23 90 top
JP12  25.4,54.1 180 top
JP13  13.46,62.23 90 top
JP14  33.53,49.02 0 top
JP15  25.65,76.45 180 top
JP16  113.28,53.34 270 top
JP17  62.48,50.29 180 top
JP18  97.03,67.31 90 top
JP19  35.81,64.01 180 top
JP20  86.11,57.15 0 top
JP21  12.7,44.96 0 top
JP22  75.44,63.5 0 top
JP23  102.62,55.88 90 top
JP24  75.44,75.18 0 top
JP25  55.63,36.83 90 top
JP26  14.35,53.72 0 top
JP27  37.34,4.95 180 top
JP28  55.63,25.96 90 top
L1  44.7,74.42 180 top
LED1  47.12,69.22 0 top
Q1  24.13,11.43 90 top
Q2  118.62,75.69 270 top
Q3  109.47,75.69 270 top
R1  33.02,30.73 180 bottom
R2  32.77,20.32 180 bottom
R3  81.03,50.55 270 bottom
R4  70.87,50.8 270 bottom
R5  30.48,54.1 90 bottom
R6  20.07,54.1 90 bottom
R7  31.5,72.9 0 bottom
R8  31.75,70.36 0 bottom
R9  5R  [R0805']  41.15,74.42 0 top
R10  51.18,69.22 180 bottom
R11  95,54.48 180 bottom
R12  95.63,57.66 0 bottom
TP1  7.49,72.77 0 top
TP2  19.68,20.95 0 top
TP3  117.35,65.28 0 top
U1  7.11,29.46 315 bottom
U2  7.11,13.72 315 bottom
U$1  18.54,4.45 0 top
U$2  120.4,68 0 top
U$3  12.95,81.03 0 top
U$4  12.95,81.03 0 bottom
U$5  120.4,68 0 bottom
U$6  18.54,4.45 0 bottom
X1  6.86,37.85 0 top
X2  6.86,22.61 0 top
X3  7.11,6.6 0 top
X4  6.86,51.56 0 top

### Tracks (layer width: path | path; a pad name or v marks a point on that pad's centre or on a via)
+3V3  (via drill 0.71)
  Top 0.254: Q3.4 Q2.1
  Top 0.381: Q3.1 102.87,78.23 102.62,77.98
  Top 0.508: LED1.A 45.6,69.22 L1.1
  Top 0.635: v14.48,13.97 14.48,3.05 12.95,1.52 2.29,1.52 1.52,2.29 1.52,81.79 3.05,83.31 41.4,83.31 C29.+
  Top 0.889: IC2.14 102.62,77.98 IC2.1
  Top 1.016: 110.82,82.74 111.16,82.64 111.09,82.56 C18.2 C16.2 111.57,79.52 Q3.4 | 110.82,82.74 108.97,83.31 | Q2.4 120.72,79.52 C17.2 C15.2 120.23,83.48 119.89,83.82 111.9,83.82 110.82,82.74
  Top 1.27: L1.1 45.97,74.42 46.74,75.18 46.74,76.45 | 46.74,76.45 46.74,77.98 C29.+ | JP9.3 58.93,77.22 58.17,76.45 46.74,76.45
  Top 1.524: 108.97,83.31 107.19,83.57 102.62,83.57 IC2.1
  Bottom 0.381: U2.1 10.09,14.63 C24.2 | U1.1 9.84,30.38 C23.2 C26.2
  Bottom 0.635: C24.2 C25.2 13.55,14.57 | 13.55,14.57 13.97,14.99 13.97,29.72 13.46,30.23 11.77,30.23 C26.2 | 13.55,14.57 13.88,14.57 v14.48,13.97
  Bottom 1.016: C5.2 101.09,76.96 102.62,78.49 IC2.1
  Bottom 1.27: C29.+ 49.53,78.23 55.12,83.82 75.95,83.82 76.58,83.19 | 76.58,83.19 76.71,83.06 JP9.18 | 76.58,83.19 76.96,83.19 77.34,83.57 102.36,83.57 102.62,83.31 102.62,82.8 IC2.1
FPGA3  (via drill 0.43)
  Top 0.254: JP9.14 71.88,81.28 72.9,80.26 72.9,74.42 v73.15,74.17 | v89.66,68.58 89.66,67.06 95,61.72 v99.06,61.72
  Top 0.381: CON1.C7 86.89,9.67 88.39,11.18 97.54,11.18 101.6,15.24 101.6,47.24 100.46,48.39 | 100.46,48.39 99.57,49.28 JP8.7 | JP23.1 102.62,50.55 100.46,48.39
  Bottom 0.254: v73.15,74.17 73.66,73.66 84.33,73.66 v89.66,68.58 | v99.06,61.72 99.06,55.37 101.35,53.09 102.36,53.09 JP23.1
FPGAIN
  Top 0.305: JP19.1 45.72,64.01 | 45.72,64.01 55.37,64.01 57.91,66.55 | 57.91,66.55 60.2,68.83 60.2,80.01 JP9.4 | JP4.5 45.72,64.01 | JP17.5 59.94,64.52 57.91,66.55
  Bottom 0.305: JP4.5 45.72,51.44 46.86,50.29 51.82,50.29 52.32,49.78 52.32,42.8 51.69,42.16 47.75,42.16 47.24,41.66 47.24,20.83 45.34,18.92 45.34,10.29 43.94,8.89 36.83,8.89 36.2,8.26 36.2,5.08 JP27.2
FPGAOUT
  Top 0.305: JP9.6 61.98,81.28 62.74,80.52 62.74,51.82 JP17.3
  Bottom 0.381: JP4.3 48.26,52.83 49.28,53.85 61.72,53.85 62.74,52.83 62.74,51.82 JP17.3
GND  (via drill 0.43, 0.71)
  Top 0.889: IC2.7 87.38,79.76 88.39,78.74 94.23,78.74 95,79.5 IC2.4
  Top 1.016: C6.1 v18.03,15.87 | C7.1 v18.03,6.6 | Q2.2 117.35,73.15 118.62,74.42 118.62,79.92 C17.1 C15.1 118.53,82.46 v118.62,82.55 | Q3.2 108.46,73.15 109.47,74.17 109.47,79.92 C16.1 C18.1 v107.82,81.28
  Top 1.27: 79.76,78.74 JP9.19 | 46.23,81.53 C29.- | 55.88,81.79 JP9.2
  Top 2.032: C29.- 55.88,81.79 | X3.3 X3.4 X3.5 X3.2 9.39,9.15 9.4,9.14 | X2.4 X2.3 X2.2 X2.5 9.13,20.06 9.14,20.07 9.4,20.07 | X1.4 X1.3 X1.2 X1.5 9.13,35.3 9.4,35.56 | X4.2 X4.3 X4.4 X4.5 X4.2
  Bottom 0.254: U2.2
  Bottom 0.381: U2.4 U2.5 U2.2 7.57,14.15 8.38,13.33 8.38,13.21 | U1.2 7.57,29.89 8.89,28.58 9.87,28.58 C23.1 C26.1 | U1.2 | U1.2 U1.5 U1.4 | 8.38,13.21 8.38,12.7 v8.64,12.45 | 8.38,13.21 9.82,13.21 C24.1 | C24.1 C25.1 v11.68,11.68 | C24.1 v10.16,11.68
  Bottom 1.016: 30.9,22.86 JP1.2 31.92,22.69 R2.1 | R4.1 71.03,51.82 JP7.2 73.41,52.92 C8.2 | C5.1 95.25,76.96 95,77.22 IC2.4 | C2.2 v26.42,23.11 | C3.2 28.96,23.62 v28.45,23.11 | v107.82,81.28 108.46,83.06 108.71,83.31
  Bottom 1.27: IC2.7 85.34,78.74 JP9.19 78.99,78.74 JP9.17 | C8.2 C9.2 74.84,59.6 75.18,59.94 79.25,59.94 | IC1.22 52.41,25.4 | 30.9,22.86 C3.2 C2.2 | C14.2 C12.2 24.13,48.43 24.13,48.77 24.3,48.93 C13.2 24.3,50.38 22.86,51.82 JP12.6 20.49,52.83 R6.1
  Bottom 1.524: 78.99,78.74 81.03,78.74 | 108.71,83.31 109.73,83.31 110.49,82.55 v118.62,82.55
  other vias: 5.33,32.26 5.08,29.97 8.64,27.94 11.68,27.43 9.91,27.43 5.08,81.28 10.16,81.28 15.24,81.28 20.32,81.28 25.4,81.28 30.48,81.28 5.08,76.2 10.16,76.2 10.16,71.12 5.08,71.12 33.02,68.58 35.56,68.58 35.56,60.96 35.56,58.42 35.56,55.88 35.56,53.34 48.26,43.18 50.8,43.18 53.34,43.18 58.42,43.18 60.96,43.18 63.5,43.18 45.09,43.18 40.64,43.18 38.1,43.18 27.94,43.18 25.4,43.18 22.86,43.18 22.23,38.1 22.23,35.56 22.23,33.02 22.23,30.48 22.23,27.94 19.05,43.18 19.05,45.09 19.05,47.62 15.24,47.62 15.24,51.44 19.05,51.44 21.59,51.44 22.23,47.62 38.1,46.36 40.64,46.36 45.09,46.36 48.26,46.36 50.8,46.36 53.34,46.36 55.88,46.36 58.42,46.36 60.96,46.36 63.5,46.36 71.12,46.36 71.12,43.18 76.83,43.82 77.47,46.99 74.93,43.18 22.86,24.13 19.68,24.77 19.05,27.94 19.05,30.48 19.05,33.02 19.05,35.56 19.05,38.1 76.2,30.48 81.28,30.48 86.36,30.48 86.36,25.4 81.28,25.4 76.2,25.4 76.2,20.95 81.28,20.95 86.36,20.95 76.2,17.15 81.28,17.15 86.36,17.15 86.36,12.7 81.28,12.7 76.2,12.7 71.12,12.7 66.04,12.7 66.04,7.62 71.12,7.62 71.12,2.54 66.04,2.54 60.96,2.54 60.96,7.62 55.88,7.62 55.88,2.54 50.8,2.54 45.72,2.54 40.64,2.54 35.56,2.54 30.48,2.54 25.4,2.54 20.32,2.54 76.2,2.54 81.28,2.54 86.36,2.54 91.44,2.54 96.52,2.54 101.6,2.54 106.68,2.54 111.76,2.54 116.84,2.54 116.84,7.62 91.44,12.7 96.52,12.7 94.61,20.95 94.61,25.4 94.61,30.48 104.14,60.96 109.22,60.96 114.3,60.96 119.38,60.96 119.38,66.04 109.22,66.04 104.14,66.04 114.3,68.58 104.14,68.58 116.84,81.28 114.3,81.28 105.28,80.9 91.44,76.2 86.36,76.2 81.28,76.2 83.82,78.74 48.26,60.96 53.34,60.96 58.42,60.96 58.42,55.88 53.34,55.88 48.26,55.88 41.91,68.58 47.62,73.03 51.44,73.03 54.61,73.03 20.95,67.95 20.95,65.41 25.4,63.5 8.89,16.51 8.26,31.75 6.99,44.45 4.45,44.45 40.89,59.31 41.02,62.86 40.89,53.21 44.7,62.99 44.58,59.31 44.58,53.34 55.12,68.96 57.02,72.01 49.28,67.56 104.14,17.15 111.76,17.15 111.76,22.23 111.76,27.3 111.76,32.39 104.14,32.39 104.14,27.3 104.14,22.23 115.82,22.35 115.82,27.43 115.82,17.27 115.82,9.65 111.89,12.45 115.7,31.5 115.7,36.58 108.97,37.85 103.76,37.72 100.08,37.72 95,37.72 87.38,37.72 82.3,37.72 77.22,37.72 64.52,37.72 64.52,30.1 64.52,25.02 103,48.64 99.82,50.93 98.3,54.48 83.19,52.07 83.19,50.16 83.19,48.13 71.12,54.23 71.12,57.02 103.76,41.27 103.76,44.32 108.97,44.32 108.97,41.27 116.08,41.4 116.08,44.32 120.4,44.32 120.4,41.53 120.4,36.58 120.4,31.5 120.4,48.26 120.4,51.94 120.4,55.63 120.4,58.93 45.85,8.74 44.63,28.58 46.63,14.15 44.04,14.25
  pour Bottom (isolate 0.254, rank 6): 0.51,84.58 122.94,84.58 123.19,84.84 123.19,-1.02 122.94,-1.27 0,-1.27 -0.25,-1.02 -0.25,84.84
  pour Top (isolate 0.254, rank 6): -1.27,84.84 0.25,0 123.19,0 123.19,84.84
MISO  (via drill 0.43)
  Top 0.254: JP9.7 64.01,72.39 v64.26,72.14 | v84.84,70.1 84.84,67.56 93.22,59.18 v97.28,59.18 | v97.79,17.78 98.3,17.78 98.81,18.29 98.81,45.47 96.27,48.01 96.27,50.55 JP8.8
  Bottom 0.254: v64.26,72.14 84.07,72.14 84.84,71.37 v84.84,70.1 | v97.28,59.18 97.28,57.02 97.28,52.07 JP8.8 | IC1.18 51.05,15.24 54.86,19.05 96.52,19.05 v97.79,17.78
  Bottom 0.406: 97.28,57.02 96.48,57.02 R12.1
MOSI  (via drill 0.43)
  Top 0.254: JP9.9 v66.55,69.85 | v82.55,69.85 82.8,66.8 v89.92,59.69 | v92.46,17.78 92.46,36.32 88.14,40.64 88.14,50.04 JP8.2
  Bottom 0.254: v66.55,69.85 v82.55,69.85 | v89.92,59.69 90.93,58.67 90.93,52.83 JP8.2 | IC1.17 50.8,12.7 52.83,14.73 52.83,16.26 55.12,18.54 91.69,18.54 v92.46,17.78
N$1
  Top 1.016: IC1.7 36.83,25.4 JP1.5
  Bottom 1.016: JP1.5 34.29,30.31 R1.2
N$2  (via drill 0.43)
  Top 0.254: JP22.3 84.58,63.5 v86.87,61.21
  Top 0.305: JP16.7 112.01,43.18 v111.76,42.93
  Top 0.381: JP8.1 89.92,43.51 CON1.C4
  Bottom 0.254: v86.87,61.21 87.38,61.21 90.17,58.17 90.17,53.85 88.39,52.07 88.39,50.8 JP8.1
  Bottom 0.305: v111.76,42.93 97.03,42.93 95.5,44.45 90.17,44.45 89.41,43.69 89.41,43.04 CON1.C4
N$3
  Top 1.016: IC1.8 JP1.1
  Bottom 1.016: R2.2 33.62,22.19 JP1.1
N$4
  Bottom 0.305: JP3.1 32,8.89 40.64,17.53 41.66,17.53 IC1.10
N$5
  Bottom 1.016: C19.1 X1.1 6.86,41.66 8.89,43.69 JP21.1
N$6
  Top 0.432: IC2.8 87.38,71.88 88.65,70.61 92.46,70.61 IC2.11 JP18.5
N$7
  Top 0.762: C7.2 24,9.14 Q1.1
  Bottom 0.305: JP3.2 24.26,8.89 Q1.1
N$8
  Top 0.762: C6.2 24,13.97 Q1.2
  Bottom 0.305: JP2.1 24.26,13.97 Q1.2
N$9
  Bottom 0.305: IC1.14 41.27,7.62 JP27.1
N$10
  Bottom 1.27: IC1.2 36.58,38.1 JP5.1
N$11
  Bottom 1.27: JP6.2 41.66,35.81 IC1.3
N$12
  Bottom 0.711: CON1.C1 81.81,45.95 JP7.5
  Bottom 1.016: R3.2 78.91,49.7 JP7.5
N$13  (via drill 0.43)
  Top 0.381: v109.73,46.74 109.73,53.85 110.49,54.61 JP16.3
  Bottom 0.381: JP8.5 95,46.74 | 95,46.74 85.85,46.74 84.33,45.21 84.33,43.04 CON1.C2 | 95,46.74 v109.73,46.74
N$14  (via drill 0.43, 0.71)
  Top 0.711: 73.72,13.01 CON1.C5
  Top 1.016: v73.41,41.66 v73.41,35.31 73.41,13.32 73.72,13.01
  Bottom 1.016: R4.2 71.54,49.28 JP7.1 v73.41,41.66 | v73.41,35.31 112.27,35.31 118.11,41.15 118.11,55.88 116.84,57.15 JP16.2
N$15
  Bottom 1.016: X3.1 C22.2
N$16  (via drill 0.43)
  Top 0.254: JP22.1 72.9,62.48 73.91,61.47 85.09,61.47 87.38,59.18 87.38,52.83 87.76,52.45 88.27,52.45 89.66,53.85 90.93,53.85 91.19,53.59 91.19,50.55 JP8.3
  Top 0.381: JP16.8 v114.55,45.72 114.55,5.84 113.79,5.08 89.59,5.08 CON1.C8 | JP8.3 92.46,45.47 v92.71,45.47
  Bottom 0.381: v92.71,45.47 114.05,45.47 v114.55,45.72
N$17
  Top 0.305: IC3.13 20.93,57.76 20.32,57.15 7.62,57.15 5.33,59.44 JP11.1
N$18
  Bottom 0.381: JP16.6 114.55,52.32 113.54,53.34 107.44,53.34 104.9,55.88 JP23.2
N$19
  Top 0.305: IC3.12 10.37,58.97 9.14,60.2 JP10.2
N$20
  Top 0.254: IC3.27 34.51,63.97 JP19.2
N$21  (via drill 0.43)
  Top 0.305: C10.1 23.62,74.17 24.13,73.66 IC3.39 24.13,69.09 v23.37,68.45
  Bottom 0.305: C11.1 v23.37,68.45
  Bottom 0.762: C11.1 24.98,67.14 26.67,68.83 29.97,68.83 32.26,66.55 JP14.1
  Bottom 1.27: JP14.1 26.76,49.02 C12.1 | C12.1 C13.1 26.16,50.29 27.94,52.07 JP12.2 30.06,52.83 R5.1 | C14.1 C12.1
N$22  (via drill 0.43)
  Top 0.254: IC3.35 27.33,72.8 27.69,73.15 v28.7,73.15
  Bottom 0.254: v28.7,73.15 30.29,73.15 R7.2
N$23  (via drill 0.43)
  Top 0.254: IC3.34 29.25,70.57 v29.46,70.36
  Bottom 0.254: v29.46,70.36 R8.2
N$24
  Top 0.305: IC3.40 23.33,71.92 23.11,72.14 18.29,72.14 16.51,70.36 16.51,61.47 16,60.96 JP13.1
N$25  (via drill 0.43)
  Top 0.381: IC3.9 20.69,62.37 21.08,61.98 21.08,61.47 v21.34,61.21 | IC3.31 28.33,67.17 v27.94,67.56 | v26.16,61.21 25.73,60.78 IC3.19 25.73,57.84 25.91,57.66
  Top 0.635: 25.91,57.66 27.69,55.88 27.69,55.63 JP12.1
  Bottom 0.762: v21.34,61.21 v26.16,61.21 27.94,62.99 v27.94,67.56
  Bottom 1.27: R5.2 28.36,54.95 JP12.1
N$26
  Top 0.381: IC3.8 19.89,63.17 | IC3.38 24.93,69.13 24.89,69.09 | IC3.30 28.27,66.37 28.19,66.29 | 24.93,60.49 IC3.18 24.93,57.7 24.89,57.66
  Top 0.635: 24.93,60.49 22.25,63.17 22.1,63.17 | JP12.5 22.86,55.63 24.89,57.66 | 24.93,69.13 24.93,68.54 26.16,67.31 | 26.16,67.31 27.18,66.29 28.19,66.29 | 19.89,63.17 22.1,63.17 | 26.16,67.31 26.16,67.23 22.1,63.17
  Bottom 0.254: 23.11,55.88 23.11,55.63 JP12.5
  Bottom 1.27: R6.2 22.19,54.95 23.11,55.88
N$27
  Top 0.305: IC3.37 25.73,75.11 JP15.2
N$28
  Top 0.305: IC3.36 26.53,76.06 JP15.1
N$29  (via drill 0.43)
  Top 0.381: v90.93,8.38 111.76,8.38 113.03,9.65 113.03,47.5 113.28,47.75 113.28,53.34 JP16.4
  Bottom 0.381: CON1.C6 84.35,7.39 85.34,8.38 v90.93,8.38
N$30  (via drill 0.43)
  Top 0.305: v110.74,39.12 110.74,50.8 JP16.5
  Bottom 0.305: JP17.6 JP17.4 JP17.2 65.53,48.51 65.53,42.16 68.58,39.12 85.6,39.12 86.89,40.41 CON1.C3 86.89,40.36 88.14,39.12 v110.74,39.12
N$31
  Bottom 0.305: JP2.2 35.05,13.97 41.4,20.32 IC1.9 45.21,20.32 46.23,21.34 46.23,48.77 JP4.6 JP4.4 JP4.2
N$32
  Top 0.508: JP20.3 JP16.1
N$33
  Bottom 0.381: C22.1 U2.3
N$34
  Top 0.508: JP18.3 106.93,67.31 111.51,71.88 111.51,73.08 Q3.3
N$35
  Top 0.508: JP18.1 113.79,64.77 120.65,71.63 120.65,73.08 Q2.3
N$36
  Bottom 0.381: 6.86,29.21 U1.3
  Bottom 0.508: C21.1 6.86,29.21
N$37
  Bottom 0.381: U2.6 6.72,17.81
  Bottom 0.508: 6.72,17.81 C20.2
N$38
  Bottom 0.381: U1.6 6.72,33.05
  Bottom 0.508: 6.72,33.05 C19.2
N$39
  Bottom 1.016: C20.1 X2.1 C21.2
N$40
  Top 1.27: L1.2 R9.2
N$41
  Top 0.508: JP25.1 IC1.24
N$42
  Top 0.508: JP25.2 IC1.25
N$43
  Top 0.508: JP25.3 IC1.26
N$44
  Top 0.508: JP25.4 IC1.27
N$45
  Top 0.508: JP25.5 IC1.28
N$46
  Bottom 0.508: LED1.K R10.1
N$47
  Top 0.305: IC1.23 54.91,27.94 JP28.2
OSCOUT  (via drill 0.43)
  Top 0.508: JP18.6 JP18.4 JP18.2 | JP17.1 v65.02,67.31
  Bottom 0.406: 64.26,50.29 57.66,50.29 56.26,51.69 50.93,51.69 JP4.1
  Bottom 0.508: v65.02,67.31 JP18.4 | JP17.1 65.02,51.05 64.26,50.29
PDIC
  Bottom 0.254: R7.1 32.51,72.9 34.54,74.93 55.63,74.93 57.4,76.71 70.87,76.71 71.63,77.47 JP9.13
PDID
  Bottom 0.254: R8.1 33.27,70.36 34.29,71.37 34.29,73.41 35.05,74.17 55.63,74.17 57.66,76.2 72.39,76.2 74.17,77.98 JP9.15
RESET  (via drill 0.43)
  Top 0.254: JP9.5 v61.47,68.33 | v87.63,68.33 87.63,67.56 v93.47,61.72 | v56.13,67.82 58.17,69.85 v58.17,72.39
  Bottom 0.254: v87.63,68.33 v61.47,68.33 61.47,72.39 v58.17,72.39 | v93.47,61.72 93.47,54.36 | 93.47,54.36 93.47,53.34 JP8.6 | IC1.1 41.91,65.02 43.43,66.55 54.86,66.55 v56.13,67.82 | 93.47,54.36 94.15,54.36 R11.1
RXD  (via drill 0.43)
  Top 0.254: JP23.3 102.62,58.67 100.58,60.71 92.96,60.71 86.36,67.31 v86.36,69.34 | JP9.10 67.06,81.28 67.82,80.52 v67.82,73.15 | v57.4,67.56 57.4,67.82 59.18,69.6 v59.18,73.66
  Bottom 0.254: v86.36,69.34 86.11,69.6 86.11,71.12 84.07,73.15 v67.82,73.15 67.82,73.66 v59.18,73.66 | JP5.2 32.26,40.13 | 32.26,40.13 33.78,42.67 36.83,42.67 40.13,39.37 43.43,39.37 44.2,40.13 44.2,41.15 43.18,42.16 43.18,65.28 43.69,65.79 55.63,65.79 v57.4,67.56 | 32.26,40.13 19.3,40.13 17.78,41.91 17.78,56.13 16,57.91 9.14,57.91 7.37,59.69 3.3,59.69 3.05,59.94 3.05,63.25 3.3,63.5 JP11.2
SCK  (via drill 0.43)
  Top 0.254: JP9.11 v69.09,70.87 | v83.57,70.87 83.57,67.56 v92.2,58.93 | v97.79,19.81 97.79,43.43 93.73,47.5 93.73,50.55 JP8.4
  Bottom 0.254: v69.09,70.87 v83.57,70.87 | v92.2,58.93 92.2,52.07 JP8.4 | IC1.19 52.83,17.78 54.61,19.56 97.54,19.56 v97.79,19.81
TRIG  (via drill 0.43)
  Top 0.254: 69.09,28.7 v69.09,42.42 | v69.09,46.23 v69.09,57.15
  Top 0.305: JP28.1 61.52,24.69 62.74,25.91 68.07,25.91 69.09,26.92 69.09,28.7
  Top 0.381: JP9.16 75.44,80.01 JP24.1 JP22.2 | v48.77,79.76 54.1,79.76 v54.36,80.01
  Bottom 0.254: v69.09,42.42 v69.09,46.23 | v69.09,57.15 69.09,65.02 70.36,66.29 74.68,66.29 75.44,65.53 JP22.2 | v54.36,80.01 72.9,80.01 JP9.16
  Bottom 0.381: JP13.2 13.46,75.69 17.53,79.76 v48.77,79.76
TXD  (via drill 0.43)
  Top 0.254: v54.1,65.02 54.1,70.36 v58.67,74.93 | v70.36,74.93 70.36,80.01 JP9.12
  Bottom 0.254: v54.1,65.02 44.2,65.02 43.69,64.52 43.69,42.42 44.7,41.4 44.7,35.31 43.69,34.29 40.13,34.29 39.37,33.53 34.04,33.53 32.77,34.8 JP6.1 32.51,35.81 30.99,37.34 30.99,38.61 30.23,39.37 19.05,39.37 17.02,41.66 17.02,56.13 16,57.15 8.89,57.15 7.11,58.93 2.79,58.93 2.29,59.44 2.29,65.02 3.3,66.04 8.38,66.04 9.14,65.28 JP10.1 | v58.67,74.93 v70.36,74.93
VCCIO  (via drill 0.71)
  Top 0.762: IC1.20 IC1.21
  Top 1.016: v67.56,27.94 v67.56,42.42 | v67.56,46.23 67.56,59.18 67.82,59.44
  Top 1.27: JP20.1 83.57,57.66 82.3,58.93 68.33,58.93 67.82,59.44 v67.82,65.53 | v39.37,72.14 39.37,73.64 R9.1 C27.1 | C28.1 C27.1 | C27.1 36.26,74.86 36.32,74.93 36.32,76.96 C30.+ | v26.67,31.24 26.67,41.15 27.18,41.66 30.73,41.66 v31.24,42.16
  Bottom 1.016: JP1.6 31.75,30.31 R1.1 | v67.56,42.42 v67.56,46.23 | C4.1 65.34,21.02 67.56,23.24 v67.56,27.94 | IC1.20 50.8,20.32 51.56,21.08 52.85,21.08 C1.1
  Bottom 1.27: v67.82,65.53 61.47,65.53 55.88,71.12 40.39,71.12 v39.37,72.14 39.37,50.04 38.35,49.02 JP14.2 34.8,47.24 34.04,46.48 31.24,46.48 v31.24,42.16 | C4.1 C1.1 | C2.1 26.77,26.5 | 26.77,26.5 C3.1 29.55,26.5 30.73,27.69 31.5,27.69 JP1.6 | 26.77,26.5 26.77,31.14 v26.67,31.24
VMON
  Top 0.508: 20.07,49.53 24.64,49.53 25.4,50.29 JP12.4 JP12.3 | 20.07,49.53 14.1,49.53 | 14.1,49.53 13.97,49.53 11.68,47.24 11.68,46.48 JP21.2 | JP1.3 JP1.4 21.84,25.4 20.57,26.67 20.57,44.7 | 20.57,44.7 20.57,49.02 20.07,49.53 | JP7.4 JP7.3 75.95,45.97 74.68,44.7 20.57,44.7 | JP26.1 14.22,53.72 13.21,52.7 13.21,50.42 14.1,49.53
  Bottom 1.016: JP21.2 7.87,46.23 6.86,47.24 X4.1
VREF  (via drill 0.43, 0.6)
  Top 0.254: v88.39,53.85 88.39,54.1 89.28,54.99 93.64,54.99 v94.78,56.13
  Top 0.61: C31.1 81.79,83.12 81.79,82.68
  Top 0.813: JP9.8 64.01,82.42 65.02,83.44 81.03,83.44 81.79,82.68 82.17,82.3 82.17,78.74 79.25,75.82 79.25,67.56 v81.03,65.79
  Bottom 0.254: R11.2 95.76,54.48 95.76,55.37 v94.78,56.13 R12.2 | 85.98,55.5 86.74,55.5 v88.39,53.85
  Bottom 0.813: v81.03,65.79 81.03,58.42 79.5,56.9
  Bottom 1.016: R3.1 78.91,51.4 JP7.6 78.49,52.41 C8.1 C9.1 76.8,56.9 79.5,56.9 82.04,54.36 84.84,54.36 85.98,55.5 86.11,55.63 JP20.2

### Text on the board
tPlace: 1 | XTAL | XMEGA16A4A | TRIG | 14/8 | GND | ChipWhisperer.com | TRIG | SOCKET | RXD | 7.37 MHz | TXD | TRIG | 3.579 MHz | CLKOUT | AX1 | AX2 | IO VREF | MOD. | EXT. | GND | VOUT | VCC | 3.3V | FPGAIN | FPGAOUT | CLKOSC | FPGAIN | FPGAOUT | CLKOSC | GND | VCC | I/O | RST | VPP | DUP. | CLK | I/O | AUX1 | AUX2 | GND | VCC | PWR | CLOCK | CLOCK | POWER | AVR-PROG | DUPLICATE | GND | RXD | TXD | LNAIN | TRIG | VCC | 7334L2622F05LF | ChipWhisperer.com | GND | GND | +20dB | ChipWhisperer.com | CLKO | ATMegaXX8 | +40dB
bPlace: GND | 5 | ATMega8/48/168/328 | 4 | PORTC | 3 | ChipWhisperer.com | 1 | 2 | Rev 10MAR2014 | PC.0 | TRIG | WARNING: | You can severly damage this board / by setting jumpers wrong. Read / manual online before use.